# EAGLE design p2-001 (EAGLE 9.6.2)
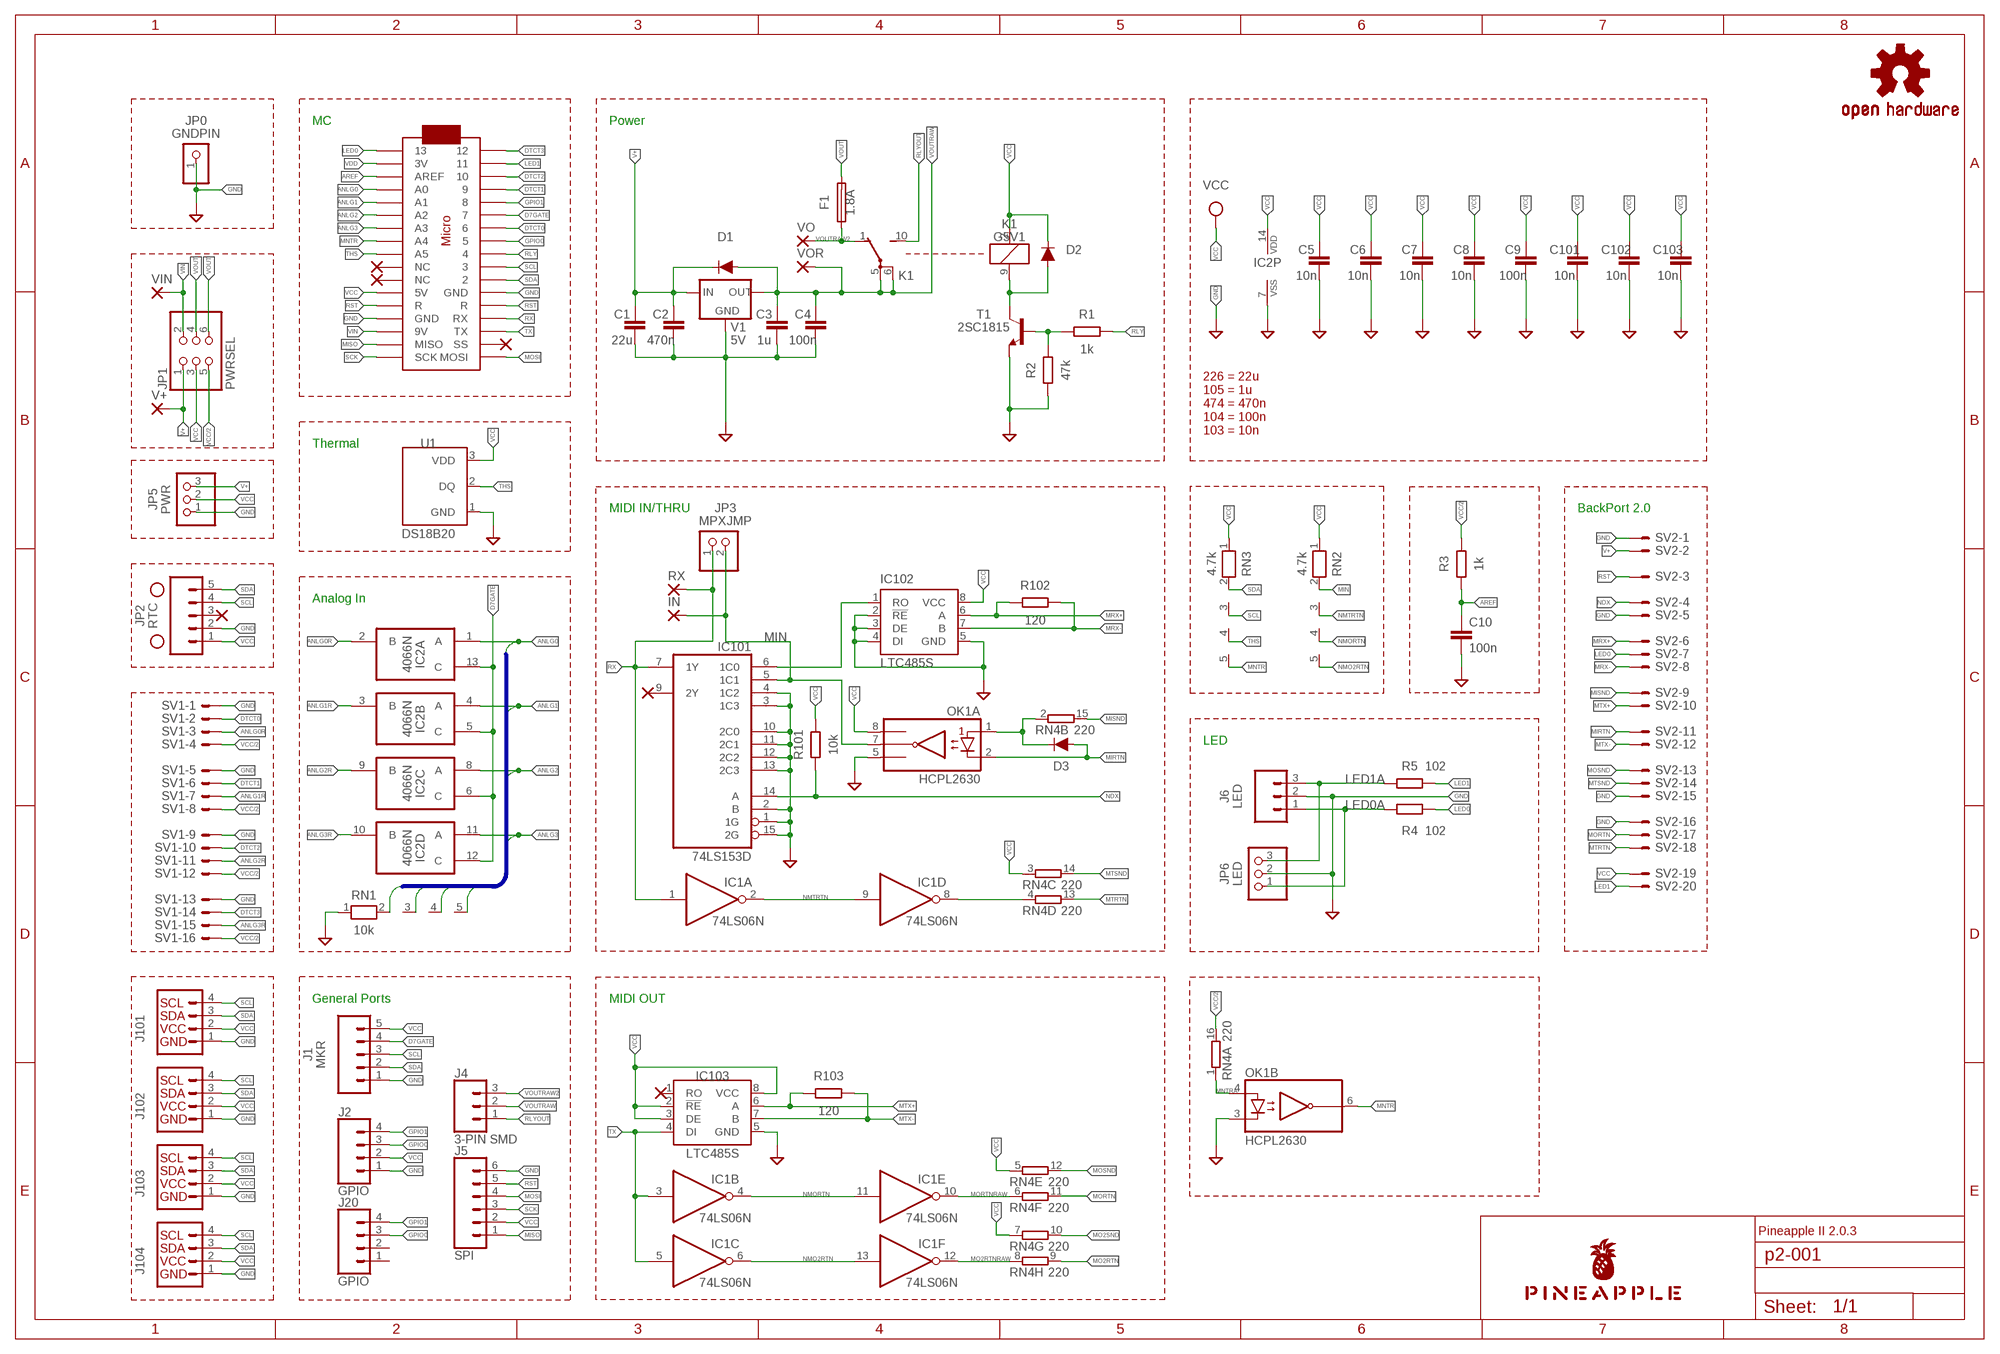
[diagram p0: schematic, sheet 1]

## Parts
C1  22u  C-EU025-050X050  [C025-050X050]
C2  470n  C-EU050-024X044  [C050-024X044]
C3  1u  C-EU050-024X044  [C050-024X044]
C4  100n  C-EU025-024X044  [C025-024X044]
C5  10n  C-EU025-024X044  [C025-024X044]
C6  10n  C-EU025-024X044  [C025-024X044]
C7  10n  C-EU025-024X044  [C025-024X044]
C8  10n  C-EU025-024X044  [C025-024X044]
C9  100n  C-EU025-024X044  [C025-024X044]
C10  100n  C-EU025-024X044  [C025-024X044]
C101  10n  C-EUC2012  [C2012]
C102  10n  C-EUC2012  [C2012]
C103  10n  C-EUC2012  [C2012]
D1  DIODE-1N4148  [DIODE-1N4148]
D2  DIODE-1N4148  [DIODE-1N4148]
D3  DIODE-1N4148  [DIODE-1N4148]
F1  1.8A  TE5  [TE5]
H1  STAND-OFF  [STAND-OFF]
H2  STAND-OFF  [STAND-OFF]
IC1  74LS06N  [DIL14]
IC2  4066N  [DIL14]
IC101  74LS153D  [SO16]
IC102  LTC485S  [SOIC8]
IC103  LTC485S  [SOIC8]
IN  SMD2  [SMD1,27-2,54]
J1  MKR  CONN_05JST  [JST-5-PTH]
J2  GPIO  CONN_04JST-PTH  [JST-4-PTH]
J4  3-PIN SMD  CONN_03JST-SMD  [JST-3-SMD]
J5  SPI  CONN_061.27MM  [1X06_1.27MM]
J6  LED  CONN_03JST-PTH  [JST-3-PTH]
J20  GPIO  CONN_041.27MM  [1X04_1.27MM]
J101  Qwiic  QWIIC_CONNECTORJS-1MM  [1X04_1MM_RA]
J102  Qwiic  QWIIC_CONNECTORJS-1MM  [1X04_1MM_RA]
J103  Qwiic  QWIIC_CONNECTORJS-1MM  [1X04_1MM_RA]
J104  Qwiic  QWIIC_CONNECTORJS-1MM  [1X04_1MM_RA]
JP0  GNDPIN  PINHD-1X1  [1X01]
JP1  PWRSEL  PINHD-2X3  [2X03]
JP2  RTC  CONN_05  [1X05]
JP3  MPXJMP  PINHD-1X2  [1X02]
JP5  PWR  PINHD-1X3  [1X03]
JP6  LED  PINHD-1X3  [1X03]
K1  G5V1  [G5V1]
LOGO1  OSHW-LOGOS-COPPER  [OSHW-LOGO-S_COPPER]
MC1  ARDUINOMICRO  [ARDUINOMICRO]
OK1  HCPL2630  [DIL08]
R1  1k  R-EU_0204/5  [0204/5]
R2  47k  R-EU_0204/5  [0204/5]
R3  1k  R-EU_0204/5  [0204/5]
R4  102  R-EU_0204/5  [0204/5]
R5  102  R-EU_0204/5  [0204/5]
R101  10k  R-EU_M2012  [M2012]
R102  120  R-EU_M2012  [M2012]
R103  120  R-EU_M2012  [M2012]
RN1  10k  RN04  [RN-5]
RN2  4.7k  RN04  [RN-5]
RN3  4.7k  RN04  [RN-5]
RN4  220  8R-N  [DIL16]
RX  SMD2  [SMD1,27-2,54]
SV1  ML16LE  [ML16L]
SV2  ML20LE  [ML20L]
T1  2SC1815  [TO92-ECB]
U1  DS18B20  [TO-92-AMMO]
U$1  PINEAPPLE450_SILK  [PINEAPPLE450_SILK]
V1  5V  78XXL  [78XXL]
V+  SMD2  [SMD1,27-2,54]
VIN  SMD2  [SMD1,27-2,54]
VO  SMD2  [SMD1,27-2,54]
VOR  SMD2  [SMD1,27-2,54]

## Nets
ANLG0 [analog]: IC2.1(A:A) MC1.P$31(A0) RN1.2
ANLG0R [analog]: IC2.2(A:B) SV1.3
ANLG1 [analog]: IC2.4(B:A) MC1.P$30(A1) RN1.3
ANLG1R [analog]: IC2.3(B:B) SV1.7
ANLG2 [analog]: IC2.8(C:A) MC1.P$29(A2) RN1.4
ANLG2R [analog]: IC2.9(C:B) SV1.11
ANLG3 [analog]: IC2.11(D:A) MC1.P$28(A3) RN1.5
ANLG3R [analog]: IC2.10(D:B) SV1.15
AREF: C10.1 MC1.P$32(AREF) R3.1
D7GATE: IC2.5(B:C) IC2.6(C:C) IC2.12(D:C) IC2.13(A:C) J1.4 MC1.P$6
DTCT0: MC1.P$7 SV1.2
DTCT1: MC1.P$4 SV1.6
DTCT2: MC1.P$3 SV1.10
DTCT3: MC1.P$1 SV1.14
GND [gnd]: C1.2 C2.2 C3.2 C4.2 C5.2 C6.2 C7.2 C8.2 C9.2 C10.2 C101.2 C102.2 C103.2 IC2.7(P:VSS) IC101.1(1G) IC101.2(B) IC101.3(1C3) IC101.4(1C2) IC101.10(2C0) IC101.11(2C1) IC101.12(2C2) IC101.13(2C3) IC101.15(2G) IC102.2(!RE) IC102.3(DE) IC102.4(DI) IC102.5(GND) IC103.5(GND) J1.1 J2.1 J5.6 J6.2 J101.1(GND) J102.1(GND) J103.1(GND) J104.1(GND) JP0.1 JP2.2 JP5.1 JP6.2 MC1.P$12(GND) MC1.P$21(GND) OK1.3(B:C2) OK1.5(A:GND) R2.1 RN1.1 SV1.1 SV1.5 SV1.9 SV1.13 SV2.1 SV2.5 SV2.15 SV2.16 T1.E U1.1(GND) V1.GND
GPIO0: J2.3 J20.3 MC1.P$8
GPIO1: J2.4 J20.4 MC1.P$5
LED0: MC1.P$34 R4.2 SV2.7
LED0A: J6.1 JP6.1 R4.1
LED1: MC1.P$2 R5.2 SV2.20
LED1A: J6.3 JP6.3 R5.1
MIDIINSND: D3.C OK1.1(A:A1) RN4.2
MIN: IC101.5(1C1) IN.1(P) JP3.2 OK1.7(A:VO1) RN2.2
MIRTN [external]: D3.A OK1.2(A:C1) SV2.11
MISND [external]: RN4.15 SV2.9
MISO: J5.1 MC1.P$19(MISO)
MNTR: MC1.P$27(A4) OK1.6(B:VO2) RN3.5
MNTRA: OK1.4(B:A2) RN4.1
MO2RTN: RN4.9
MO2RTNRAW: IC1.12(F:O) RN4.8
MO2SND: RN4.10
MORTN: RN4.11 SV2.17
MORTNRAW: IC1.10(E:O) RN4.6
MOSI: J5.4 MC1.P$17(MOSI)
MOSND: RN4.12 SV2.13
MRX: IC101.6(1C0) IC102.1(RO)
MRX+: IC102.6(A) R102.1 SV2.6
MRX-: IC102.7(B) R102.2 SV2.8
MTRTN: RN4.13 SV2.18
MTRTNRAW: IC1.8(D:O) RN4.4
MTSND: RN4.14 SV2.14
MTX+: IC103.6(A) R103.1 SV2.10
MTX-: IC103.7(B) R103.2 SV2.12
NDX: IC101.14(A) R101.1 SV2.4
NMO2RTN: IC1.6(C:O) IC1.13(F:I) RN2.5
NMORTN: IC1.4(B:O) IC1.11(E:I) RN2.4
NMTRTN: IC1.2(A:O) IC1.9(D:I) RN2.3
RLY: MC1.P$9 R1.2
RLYDRV: R1.1 R2.2 T1.B
RLYOUT: J4.1 K1.10(2:S)
RLYSNK: D2.A K1.9 T1.C
RST: J5.5 MC1.P$13(R) MC1.P$22(R) SV2.3
RX: IC1.1(A:I) IC101.7(1Y) JP3.1 MC1.P$14(RX) RX.1(P)
SCK: J5.3 MC1.P$18(SCK)
SCL: J1.3 J101.4(SCL) J102.4(SCL) J103.4(SCL) J104.4(SCL) JP2.4 MC1.P$10 RN3.3
SDA: J1.2 J101.3(SDA) J102.3(SDA) J103.3(SDA) J104.3(SDA) JP2.5 MC1.P$11 RN3.2
THS: MC1.P$26(A5) RN3.4 U1.2(DQ)
TX: IC1.3(B:I) IC1.5(C:I) IC103.4(DI) MC1.P$15(TX)
V+ [superpower]: C1.1 C2.1 D1.C JP1.1 JP5.3 SV2.2 V1.IN V+.1(P)
VCC [power]: C5.1 C6.1 C7.1 C8.1 C9.1 C101.1 C102.1 C103.1 D2.C IC2.14(P:VDD) IC102.8(VCC) IC103.2(!RE) IC103.3(DE) IC103.8(VCC) J1.5 J2.2 J5.2 J101.2(VCC) J102.2(VCC) J103.2(VCC) J104.2(VCC) JP1.3 JP2.1 JP5.2 K1.2 MC1.P$23(5V) OK1.8(A:VCC) R101.2 RN2.1 RN3.1 RN4.3 RN4.5 RN4.7 SV2.19 U1.3(VDD)
VCC/2 [superpower]: JP1.5 R3.2 RN4.16 SV1.4 SV1.8 SV1.12 SV1.16
VDD [power]: MC1.P$33(3V)
VIN [superpower]: JP1.2 MC1.P$20(9V) VIN.1(P)
VOUT [superpower]: F1.2 JP1.4 JP1.6
VOUTRAW [superpower]: C3.1 C4.1 D1.A J4.2 K1.5(2:P) K1.6(2:P) V1.OUT VOR.1(P)
VOUTRAW2 [superpower]: F1.1 J4.3 K1.1(2:O) VO.1(P)
Unconnected: IC101.9(2Y) IC103.1(RO) J20.1 J20.2 JP2.3 MC1.P$16(SS) MC1.P$24(NC) MC1.P$25(NC)

## Buses
ANLG[0..3]

## Notes on the sheet
- MC | Power
- 226 = 22u
  105 = 1u
  474 = 470n
  104 = 100n
  103 = 10n
- Thermal
- MIDI IN/THRU | BackPort 2.0
- Analog In
- LED
- General Ports | MIDI OUT
- Pineapple II 2.0.3

## Power pins joined to a net without a drawn wire
GND: IC1.7(P:GND) IC101.8(GND)
VCC: IC1.14(P:VCC) IC101.16(VCC)

## Library data of the parts
C1-C4 C9 C10 C101-C103 = rcl:C-EU: CAPACITOR, European symbol; SPICEPREFIX: C
C5-C8 = resistor:C-EU: CAPACITOR, European symbol
D1-D3 = SparkFun-DiscreteSemi:DIODE: Diode These are standard reverse protection diodes and small signal diodes. SparkFun Products: SparkFun SparkPunk Sound Kit <https://www.sparkfun.com/products/11177> SparkFun ESP8266 Thing <https://www.sparkfun.com/products/13231>; PROD_ID: DIO-08378; VALUE: 200mA/100V/1V
F1 = fuse:TE5: FUSE Wickmann; OC_FARNELL: unknown; OC_NEWARK: unknown
H1 H2 = SparkFun-Hardware:STAND-OFF: Stand Off Drill holes for mechanically mounting via screws, standoffs, etc. Note: Use the keepout ring to avoid running the screw head into surrounding components. Variant Overviews STAND-OFF - Mechanical footprint for a #4 phillips button head screw. STAND-OFF-TIGHT - Mechanical footprint for a #4 phillips button head screw, Example SparkFun Products Screw - Phillips Head (1/4", 4-40, 10 pack) <https://www.sparkfun.com/products/10453> (PRT-10453) Screw - Phillips Head (1/2", 4-40, 10 pack) <https://www.sparkfun.com/products/10452> (PRT-10452) Screw - Phillips Head (3/4", 4-40, 10 pack) <https://www.sparkfun.com/products/10451> (PRT-10451) Screw - Phillips Head (1", 4-40, 10 pack) <https://www.sparkfun.com/products/10450> (PRT-10450)
IC1 = 74xx-us:74*06: Hex INVERTER, open collector high-voltage output
IC2 = 40xx:4066: Quad bilateral ANALOG SWITCH
IC101 = 74xx-us:74*153: Dual 4-line to 1-line data SELECTOR/MULTIPLEXER
IC102 IC103 = linear-technology:LTC485: Low Power RS485 Interface Transceiver Source: http://www.linear.com/pc/downloadDocument.do?navId=H0,C1,C1007,C1017,P2064,D1718; OC_FARNELL: unknown; OC_NEWARK: unknown
IN RX V+ VIN VO VOR = wirepad:SMD2: SMD PAD
J1 = SparkFun-Connectors:CONN_05: Multi connection point. Often used as Generic Header-pin footprint for 0.1 inch spaced/style header connections On any of the 0.1 inch spaced packages, you can populate with these: Break Away Headers - Straight <https://www.sparkfun.com/products/116> (PRT-00116) Break Away Male Headers - Right Angle <https://www.sparkfun.com/products/553> (PRT-00553) Female Headers <https://www.sparkfun.com/products/115> (PRT-00115) Break Away Headers - Machine Pin <https://www.sparkfun.com/products/117> (PRT-00117) Break Away Female Headers - Swiss Machine Pin <https://www.sparkfun.com/products/743> (PRT-00743) For SCREWTERMINALS and SPRING TERMINALS visit here: Screw Terimnals on SparkFun.com <https://www.sparkfun.com/search/results?term=Screw+Terminals> (5mm/3.5mm/2.54mm spacing) This device is also useful as a general connection point to wire up your design to another part of your project. Our various solder wires solder well into these plated through hole pads. Hook-Up Wire - Assortment (Stranded, 22 AWG) <https://www.sparkfun.com/products/11375> (PRT-11375) Hook-Up Wire - Assortment (Solid Core, 22 AWG) <https://www.sparkfun.com/products/11367> (PRT-11367) View the entire wire category on our website here <https://www.sparkfun.com/categories/141> Special notes: Molex polarized connector foot print use with SKU : PRT-08231 with associated crimp pins and housings. 1MM SMD Version SKU: PRT-10208; SF_ID: PRT-09917
J2 = SparkFun-Connectors:CONN_04: Multi connection point. Often used as Generic Header-pin footprint for 0.1 inch spaced/style header connections On any of the 0.1 inch spaced packages, you can populate with these: Break Away Headers - Straight <https://www.sparkfun.com/products/116> (PRT-00116) Break Away Male Headers - Right Angle <https://www.sparkfun.com/products/553> (PRT-00553) Female Headers <https://www.sparkfun.com/products/115> (PRT-00115) Break Away Headers - Machine Pin <https://www.sparkfun.com/products/117> (PRT-00117) Break Away Female Headers - Swiss Machine Pin <https://www.sparkfun.com/products/743> (PRT-00743) For SCREWTERMINALS and SPRING TERMINALS visit here: Screw Terimnals on SparkFun.com <https://www.sparkfun.com/search/results?term=Screw+Terminals> (5mm/3.5mm/2.54mm spacing) This device is also useful as a general connection point to wire up your design to another part of your project. Our various solder wires solder well into these plated through hole pads. Hook-Up Wire - Assortment (Stranded, 22 AWG) <https://www.sparkfun.com/products/11375> (PRT-11375) Hook-Up Wire - Assortment (Solid Core, 22 AWG) <https://www.sparkfun.com/products/11367> (PRT-11367) View the entire wire category on our website here <https://www.sparkfun.com/categories/141> Special notes: Molex polarized connector foot print use with SKU : PRT-08231 with associated crimp pins and housings. 1MM SMD Version SKU: PRT-10208; PROD_ID: WIRE-13531; SF_ID: PRT-09916
J4 = SparkFun-Connectors:CONN_03: Multi connection point. Often used as Generic Header-pin footprint for 0.1 inch spaced/style header connections On any of the 0.1 inch spaced packages, you can populate with these: Break Away Headers - Straight <https://www.sparkfun.com/products/116> (PRT-00116) Break Away Male Headers - Right Angle <https://www.sparkfun.com/products/553> (PRT-00553) Female Headers <https://www.sparkfun.com/products/115> (PRT-00115) Break Away Headers - Machine Pin <https://www.sparkfun.com/products/117> (PRT-00117) Break Away Female Headers - Swiss Machine Pin <https://www.sparkfun.com/products/743> (PRT-00743) Stackable Header - 3 Pin (Female, 0.1") <https://www.sparkfun.com/products/13875> (PRT-13875) For SCREWTERMINALS and SPRING TERMINALS visit here: Screw Terimnals on SparkFun.com <https://www.sparkfun.com/search/results?term=Screw+Terminals> (5mm/3.5mm/2.54mm spacing) This device is also useful as a general connection point to wire up your design to another part of your project. Our various solder wires solder well into these plated through hole pads. Hook-Up Wire - Assortment (Stranded, 22 AWG) <https://www.sparkfun.com/products/11375> (PRT-11375) Hook-Up Wire - Assortment (Solid Core, 22 AWG) <https://www.sparkfun.com/products/11367> (PRT-11367) View the entire wire category on our website here <https://www.sparkfun.com/categories/141> Special notes: Molex polarized connector foot print use with SKU : PRT-08232 with associated crimp pins and housings.; PROD_ID: CONN-12591
J5 = SparkFun-Connectors:CONN_06: Multi connection point. Often used as Generic Header-pin footprint for 0.1 inch spaced/style header connections On any of the 0.1 inch spaced packages, you can populate with these: Break Away Headers - Straight <https://www.sparkfun.com/products/116> (PRT-00116) Break Away Male Headers - Right Angle <https://www.sparkfun.com/products/553> (PRT-00553) Female Headers <https://www.sparkfun.com/products/115> (PRT-00115) Break Away Headers - Machine Pin <https://www.sparkfun.com/products/117> (PRT-00117) Break Away Female Headers - Swiss Machine Pin <https://www.sparkfun.com/products/743> (PRT-00743) Arduino Stackable Header - 6 Pin <https://www.sparkfun.com/products/9280> (PRT-09280) For SCREWTERMINALS and SPRING TERMINALS visit here: Screw Terimnals on SparkFun.com <https://www.sparkfun.com/search/results?term=Screw+Terminals> (5mm/3.5mm/2.54mm spacing) This device is also useful as a general connection point to wire up your design to another part of your project. Our various solder wires solder well into these plated through hole pads. Hook-Up Wire - Assortment (Stranded, 22 AWG) <https://www.sparkfun.com/products/11375> (PRT-11375) Hook-Up Wire - Assortment (Solid Core, 22 AWG) <https://www.sparkfun.com/products/11367> (PRT-11367) View the entire wire category on our website here <https://www.sparkfun.com/categories/141>
J6 = SparkFun-Connectors:CONN_03: Multi connection point. Often used as Generic Header-pin footprint for 0.1 inch spaced/style header connections On any of the 0.1 inch spaced packages, you can populate with these: Break Away Headers - Straight <https://www.sparkfun.com/products/116> (PRT-00116) Break Away Male Headers - Right Angle <https://www.sparkfun.com/products/553> (PRT-00553) Female Headers <https://www.sparkfun.com/products/115> (PRT-00115) Break Away Headers - Machine Pin <https://www.sparkfun.com/products/117> (PRT-00117) Break Away Female Headers - Swiss Machine Pin <https://www.sparkfun.com/products/743> (PRT-00743) Stackable Header - 3 Pin (Female, 0.1") <https://www.sparkfun.com/products/13875> (PRT-13875) For SCREWTERMINALS and SPRING TERMINALS visit here: Screw Terimnals on SparkFun.com <https://www.sparkfun.com/search/results?term=Screw+Terminals> (5mm/3.5mm/2.54mm spacing) This device is also useful as a general connection point to wire up your design to another part of your project. Our various solder wires solder well into these plated through hole pads. Hook-Up Wire - Assortment (Stranded, 22 AWG) <https://www.sparkfun.com/products/11375> (PRT-11375) Hook-Up Wire - Assortment (Solid Core, 22 AWG) <https://www.sparkfun.com/products/11367> (PRT-11367) View the entire wire category on our website here <https://www.sparkfun.com/categories/141> Special notes: Molex polarized connector foot print use with SKU : PRT-08232 with associated crimp pins and housings.; PROD_ID: WIRE-10037; SF_ID: PRT-09915
J20 = SparkFun-Connectors:CONN_04: Multi connection point. Often used as Generic Header-pin footprint for 0.1 inch spaced/style header connections On any of the 0.1 inch spaced packages, you can populate with these: Break Away Headers - Straight <https://www.sparkfun.com/products/116> (PRT-00116) Break Away Male Headers - Right Angle <https://www.sparkfun.com/products/553> (PRT-00553) Female Headers <https://www.sparkfun.com/products/115> (PRT-00115) Break Away Headers - Machine Pin <https://www.sparkfun.com/products/117> (PRT-00117) Break Away Female Headers - Swiss Machine Pin <https://www.sparkfun.com/products/743> (PRT-00743) For SCREWTERMINALS and SPRING TERMINALS visit here: Screw Terimnals on SparkFun.com <https://www.sparkfun.com/search/results?term=Screw+Terminals> (5mm/3.5mm/2.54mm spacing) This device is also useful as a general connection point to wire up your design to another part of your project. Our various solder wires solder well into these plated through hole pads. Hook-Up Wire - Assortment (Stranded, 22 AWG) <https://www.sparkfun.com/products/11375> (PRT-11375) Hook-Up Wire - Assortment (Solid Core, 22 AWG) <https://www.sparkfun.com/products/11367> (PRT-11367) View the entire wire category on our website here <https://www.sparkfun.com/categories/141> Special notes: Molex polarized connector foot print use with SKU : PRT-08231 with associated crimp pins and housings. 1MM SMD Version SKU: PRT-10208
J101-J104 = SparkFun-Connectors:QWIIC_CONNECTOR: SparkFun I2C Standard Qwiic Connector An SMD 1mm pitch JST connector makes it easy and quick (get it? Qwiic?) to connect I2C devices to each other. The Qwiic system <http://www.sparkfun.com/qwiic> enables fast and solderless connection between popular platforms and various sensors and actuators. We carry 200mm <https://www.sparkfun.com/products/14204>, 100mm <https://www.sparkfun.com/products/14205>, 50mm <https://www.sparkfun.com/products/14206>, and breadboard friendly <https://www.sparkfun.com/products/14207> Qwiic cables. We also offer 10 pcs strips <https://www.sparkfun.com/products/14323> the SMD connectors.
JP0 = pinhead:PINHD-1X1: PIN HEADER
JP1 = pinhead:PINHD-2X3: PIN HEADER
JP2 = SparkFun-Connectors:CONN_05: Multi connection point. Often used as Generic Header-pin footprint for 0.1 inch spaced/style header connections On any of the 0.1 inch spaced packages, you can populate with these: Break Away Headers - Straight <https://www.sparkfun.com/products/116> (PRT-00116) Break Away Male Headers - Right Angle <https://www.sparkfun.com/products/553> (PRT-00553) Female Headers <https://www.sparkfun.com/products/115> (PRT-00115) Break Away Headers - Machine Pin <https://www.sparkfun.com/products/117> (PRT-00117) Break Away Female Headers - Swiss Machine Pin <https://www.sparkfun.com/products/743> (PRT-00743) For SCREWTERMINALS and SPRING TERMINALS visit here: Screw Terimnals on SparkFun.com <https://www.sparkfun.com/search/results?term=Screw+Terminals> (5mm/3.5mm/2.54mm spacing) This device is also useful as a general connection point to wire up your design to another part of your project. Our various solder wires solder well into these plated through hole pads. Hook-Up Wire - Assortment (Stranded, 22 AWG) <https://www.sparkfun.com/products/11375> (PRT-11375) Hook-Up Wire - Assortment (Solid Core, 22 AWG) <https://www.sparkfun.com/products/11367> (PRT-11367) View the entire wire category on our website here <https://www.sparkfun.com/categories/141> Special notes: Molex polarized connector foot print use with SKU : PRT-08231 with associated crimp pins and housings. 1MM SMD Version SKU: PRT-10208
JP3 = pinhead:PINHD-1X2: PIN HEADER
JP5 JP6 = pinhead:PINHD-1X3: PIN HEADER
K1 = relay:G5V1: RELAY 1 x switch, 0.5 A/125 V AC, 1 A/24 V DC , Omron; MPN: G5V-1-DC24; OC_FARNELL: 9949593; OC_NEWARK: 36M6377
LOGO1 = SparkFun-Aesthetics:OSHW-LOGO: Open-Source Hardware (OSHW) Logo This logo indicates the piece of hardware it is found on incorporates a OSHW license and/or adheres to the definition of open source hardware found here: http://freedomdefined.org/OSHW
MC1 = adafruit:ARDUINOMICRO
OK1 = optocoupler:HCPL2630: HEWLETT PACKARD OPTO COUPLER; MF: AGILENT TECHNOLOGIES; MPN: HCPL-2630-000E; OC_FARNELL: 9994904; OC_NEWARK: 88H7813
R1-R5 = resistor:R-EU_: RESISTOR, European symbol
R101-R103 = rcl:R-EU_: RESISTOR, European symbol; SPICEPREFIX: R
RN1-RN3 = resistor-net:RN04: RESISTOR NETWORK; OC_FARNELL: unknown; OC_NEWARK: unknown
RN4 = resistor-dil:8R-N: DIL RESISTOR; OC_FARNELL: unknown; OC_NEWARK: unknown
SV1 = con-ml:ML16LE: HARTING; OC_FARNELL: unknown; OC_NEWARK: unknown
SV2 = con-ml:ML20LE: HARTING; OC_FARNELL: unknown; OC_NEWARK: unknown
T1 = transistor:2SC1815: NPN EPITAXIAL TRANSISTOR Source: TOSHIBA .. 2SC1815 1.pdf
U1 = SparkFun-Sensors:DS18B20: Dallas/Maxim DS18B20 1-Wire Temperature Sensor The DS18B20 reports degrees C with 9 to 12-bit precision, -55C to 125C (+/-0.5C). Each sensor has a unique 64-Bit Serial number etched into it - allows for a huge number of sensors to be used on one data bus. Datasheet <http://datasheets.maximintegrated.com/en/ds/DS18B20.pdf> SparkFun Products One Wire Digital Temperature Sensor - DS18B20 <https://www.sparkfun.com/products/245> (SEN-00245); STORE_ID: SEN-00245
U$1 = pineapple:PINEAPPLE450_SILK
V1 = v-reg:78XXL: VOLTAGE REGULATOR

## Net classes
0 default: width 0.152 mm, drill 0.152 mm, clearance 0.152 mm
1 gnd: width 0.305 mm, drill 0.152 mm, clearance 0.152 mm
2 power: width 0.508 mm, drill 0.152 mm, clearance 0.152 mm
3 analog: width 0.305 mm, drill 0.152 mm, clearance 0.152 mm
4 external: width 0.152 mm, drill 0.152 mm, clearance 0.152 mm
5 superpower: width 1.016 mm, drill 0.152 mm, clearance 0.152 mm

## Board
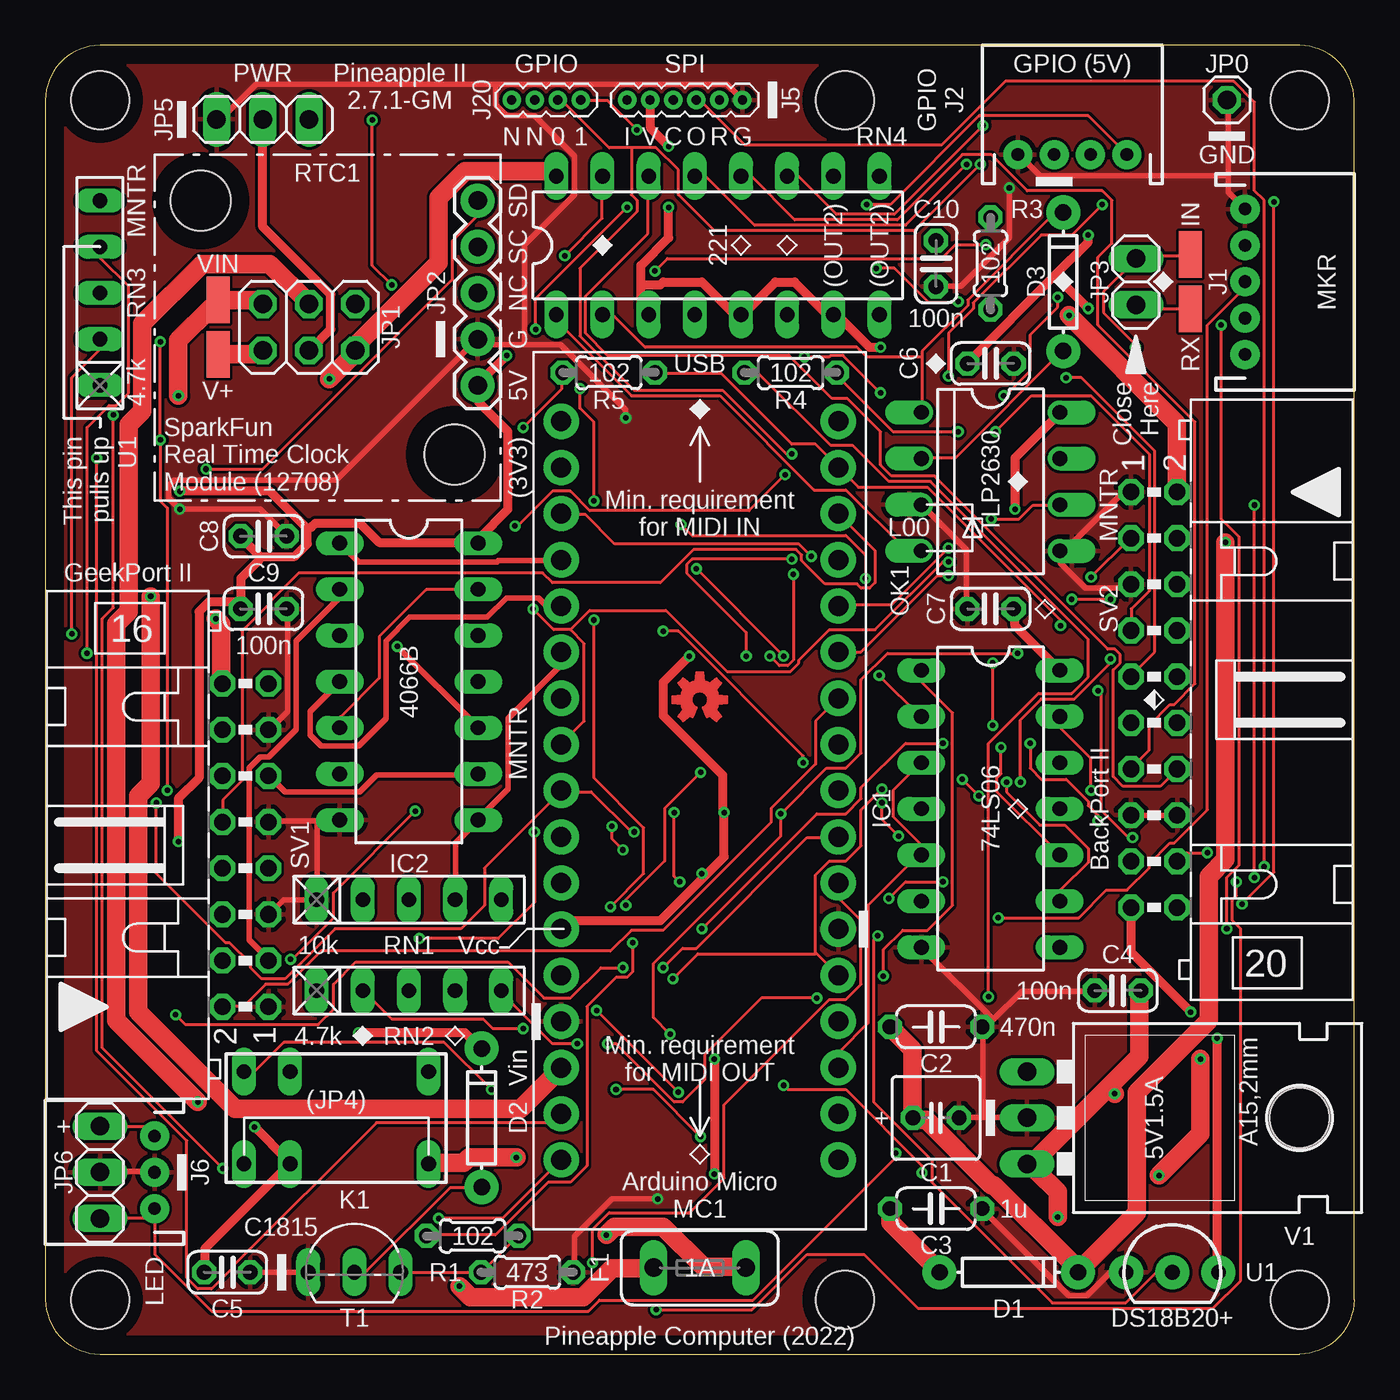
[diagram p1: board, top side]
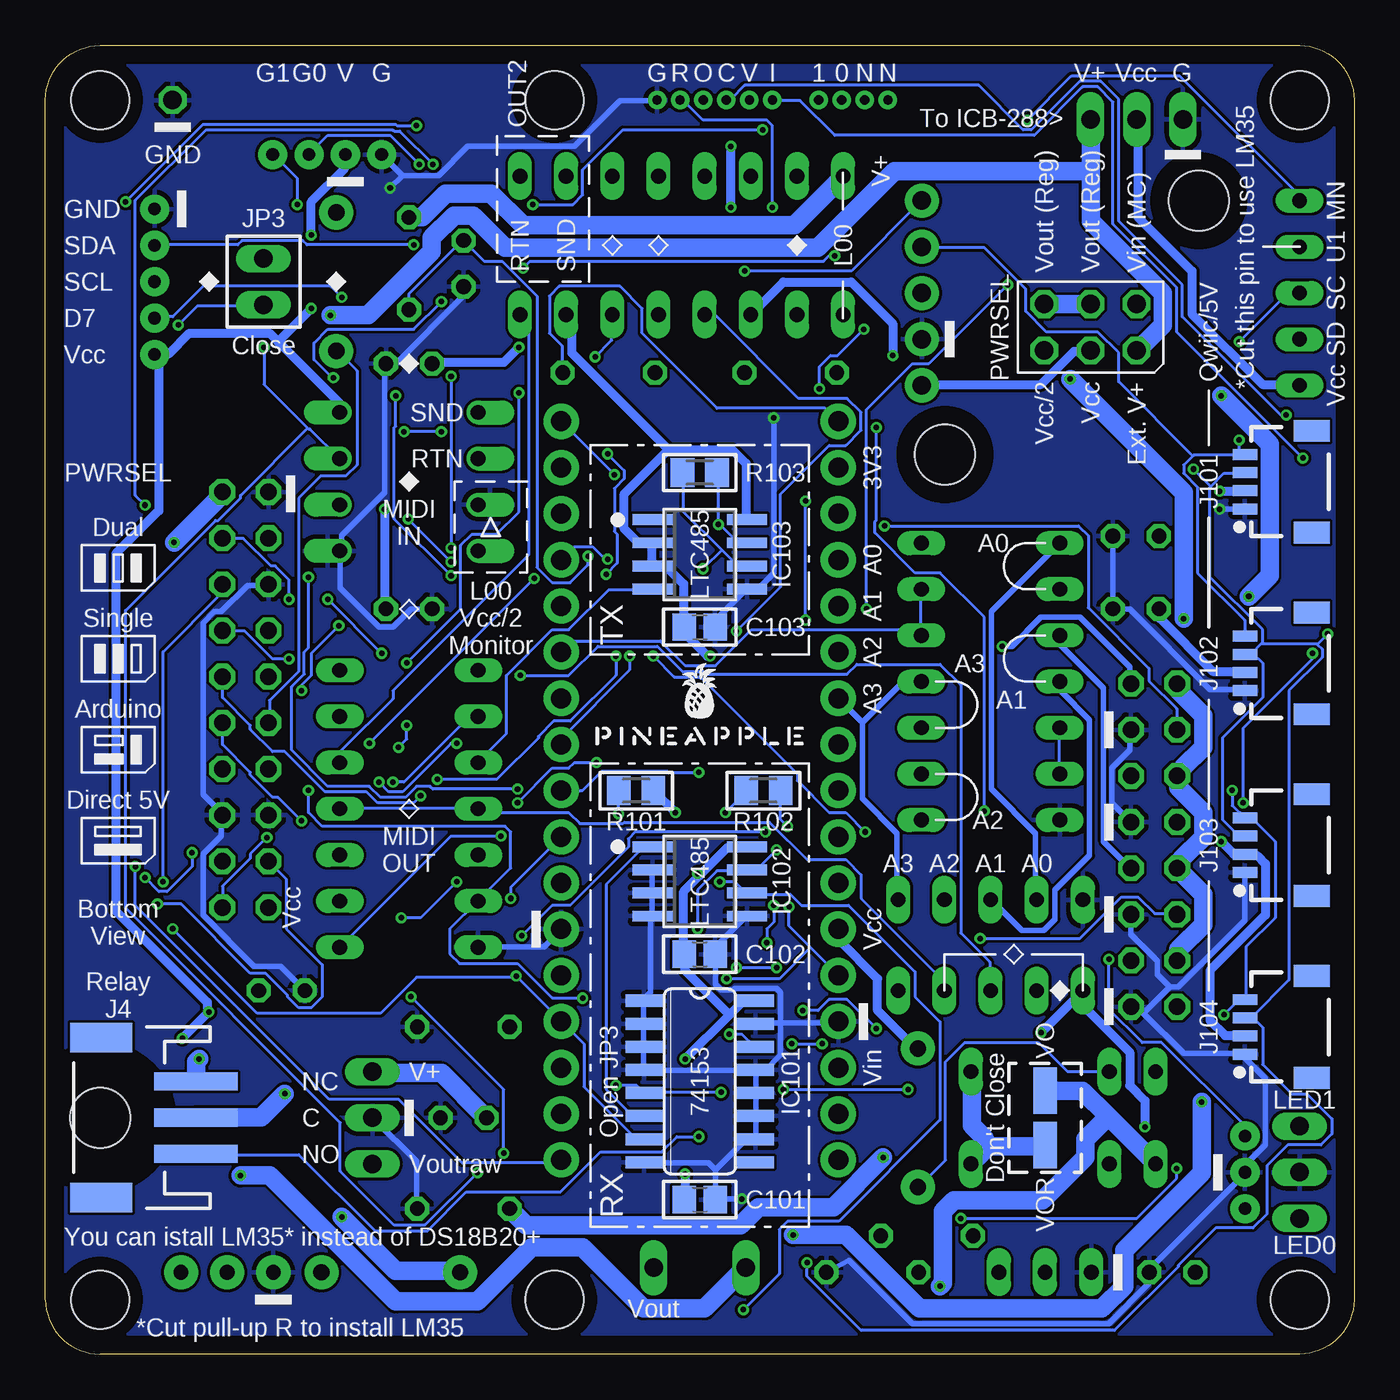
[diagram p2: board, bottom side, seen from below]

Size 72 x 72 mm. Coordinates in mm from the lower left corner, seen from the top.
Outline: 3,0 69,0 arc90 72,3 72,69 arc90 69,72 3,72 arc90 0,69 0,3 arc90 3,0
Copper layers (1*16): Top 0.035mm / dielectric 1.5mm / Bottom 0.035mm
Design rules "SeeedStudio_2layer_DRU_no_angle_20140221": minimum track width 6mil, minimum drill 12mil, track to track 6mil, track to pad 6mil, pad to pad 6mil, via to via 6mil, smd to smd 0mil, copper to edge 10mil, drill to drill 10mil, minimum pad ring 10mil, minimum via ring 6mil, stop-mask expansion 2mil, vias tented up to drill 100mil, thermal gap 10mil
Holes 3.2 mm at 3,3 69,3 69,69 3,69 44,69 44,3
tRestrict: area 0.8,66.8 to 5.2,71.2; area 66.8,66.8 to 71.2,71.2; area 0.8,0.8 to 5.2,5.2; area 66.8,0.8 to 71.2,5.2; area 41.8,66.8 to 46.2,71.2; area 41.8,0.8 to 46.2,5.2; area 0,71 to 72,72; area 0,0 to 72,1; area 0,0 to 1,72; area 71,0 to 72,72; area 5.9,60.9 to 11.1,66.1; area 19.9,46.9 to 25.1,52.1
bRestrict: area 0.8,0.8 to 5.2,5.2; area 66.8,0.8 to 71.2,5.2; area 66.8,66.8 to 71.2,71.2; area 0.8,66.8 to 5.2,71.2; area 41.8,66.8 to 46.2,71.2; area 41.8,0.8 to 46.2,5.2; area 0,71 to 72,72; area 0,0 to 72,1; area 0,0 to 1,72; area 71,0 to 72,72; area 5.9,60.9 to 11.1,66.1; area 19.9,46.9 to 25.1,52.1
vRestrict: area 30,33 to 42,38

### Footprints (pad centres in the part's own frame; a part is rotated, then mirrored left to right if it is on the bottom)
C025-050X050 = drill 0.813 octagon: 1 -1.27,0; 2 1.27,0
C050-024X044 = drill 0.813 octagon: 1 -2.54,0; 2 2.54,0
C025-024X044 = drill 0.813 octagon: 1 -1.27,0; 2 1.27,0
C2012 = smd 1.3 x 1.5: 1 -0.85,0; 2 0.85,0
DIODE-1N4148 = drill 0.9 pad 1.88: A -3.81,0; C 3.81,0
TE5 = drill 1.016 long: 1 -2.54,0; 2 2.54,0
STAND-OFF = hole 3.302: 0,0
DIL14 = drill 0.813 long: 1 -7.62,-3.81; 2 -5.08,-3.81; 3 -2.54,-3.81; 4 0,-3.81; 5 2.54,-3.81; 6 5.08,-3.81; 7 7.62,-3.81; 8 7.62,3.81; 9 5.08,3.81; 10 2.54,3.81; 11 0,3.81; 12 -2.54,3.81; 13 -5.08,3.81; 14 -7.62,3.81
SO16 = smd 0.66 x 2.032: 1 -4.445,-3.073; 2 -3.175,-3.073; 3 -1.905,-3.073; 4 -0.635,-3.073; 5 0.635,-3.073; 6 1.905,-3.073; 7 3.175,-3.073; 8 4.445,-3.073; 9 4.445,3.073; 10 3.175,3.073; 11 1.905,3.073; 12 0.635,3.073; 13 -0.635,3.073; 14 -1.905,3.073; 15 -3.175,3.073; 16 -4.445,3.073
SOIC8 = smd 0.6 x 2.2: 1 -1.905,-2.6; 2 -0.635,-2.6; 3 0.635,-2.6; 4 1.905,-2.6; 5 1.905,2.6; 6 0.635,2.6; 7 -0.635,2.6; 8 -1.905,2.6
SMD1,27-2,54 = smd 1.27 x 2.54: 1 0,0
JST-5-PTH = drill 0.7 pad 1.6: 1 -4,0; 2 -2,0; 3 0,0; 4 2,0; 5 4,0
JST-4-PTH = drill 0.7 pad 1.6: 1 -3,0; 2 -1,0; 3 1,0; 4 3,0
JST-3-SMD = smd 1 x 4.6: 1 -1.99,-4.77; 2 0.01,-4.77; 3 2.01,-4.77 | smd 1.6 x 3.4: NC1 -4.39,0.43; NC2 4.41,0.43
1X06_1.27MM = drill 0.508 pad 1: 1 0,0; 2 1.27,0; 3 2.54,0; 4 3.81,0; 5 5.08,0; 6 6.35,0
JST-3-PTH = drill 0.7 pad 1.6: 1 -2,0; 2 0,0; 3 2,0
1X04_1.27MM = drill 0.508 pad 1: 1 0,0; 2 1.27,0; 3 2.54,0; 4 3.81,0
1X04_1MM_RA = smd 0.6 x 1.35: 1 -1.5,0; 2 -0.5,0; 3 0.5,0; 4 1.5,0 | smd 1.2 x 2: NC1 2.8,-3.675; NC2 -2.8,-3.675
1X01 = drill 1.016 octagon: 1 0,0
2X03 = drill 1.016 octagon: 1 -2.54,-1.27; 2 -2.54,1.27; 3 0,-1.27; 4 0,1.27; 5 2.54,-1.27; 6 2.54,1.27
1X05 = drill 1.016 pad 1.88: 1 0,0; 2 2.54,0; 3 5.08,0; 4 7.62,0; 5 10.16,0
1X02 = drill 1.016 long: 1 -1.27,0; 2 1.27,0
1X03 = drill 1.016 long: 1 -2.54,0; 2 0,0; 3 2.54,0
G5V1 = drill 0.813 long: 1 -5.08,-2.54; 2 -2.54,-2.54; 5 5.08,-2.54; 6 5.08,2.54; 9 -2.54,2.54; 10 -5.08,2.54
ARDUINOMICRO = drill 1.1 pad 1.93: P$1 -20.32,7.62; P$2 -17.78,7.62; P$3 -15.24,7.62; P$4 -12.7,7.62; P$5 -10.16,7.62; P$6 -7.62,7.62; P$7 -5.08,7.62; P$8 -2.54,7.62; P$9 0,7.62; P$10 2.54,7.62; P$11 5.08,7.62; P$12 12.7,-7.62; P$13 10.16,-7.62; P$14 12.7,7.62; P$15 15.24,7.62; P$16 17.78,7.62; P$17 20.32,7.62; P$18 20.32,-7.62; P$19 17.78,-7.62; P$20 15.24,-7.62; P$21 7.62,7.62; P$22 10.16,7.62; P$23 7.62,-7.62; P$24 5.08,-7.62; P$25 2.54,-7.62; P$26 0,-7.62; P$27 -2.54,-7.62; P$28 -5.08,-7.62; P$29 -7.62,-7.62; P$30 -10.16,-7.62; P$31 -12.7,-7.62; P$32 -15.24,-7.62; P$33 -17.78,-7.62; P$34 -20.32,-7.62
DIL08 = drill 0.813 offset: 1 -3.81,-3.81; 2 -1.27,-3.81; 3 1.27,-3.81; 4 3.81,-3.81; 5 3.81,3.81; 6 1.27,3.81; 7 -1.27,3.81; 8 -3.81,3.81
0204/5 = drill 0.813 octagon: 1 -2.54,0; 2 2.54,0
M2012 = smd 1.3 x 1.6: 1 -0.95,0; 2 0.95,0
RN-5 = drill 0.813 long: 1 -5.08,0; 2 -2.54,0; 3 0,0; 4 2.54,0; 5 5.08,0
DIL16 = drill 0.813 long: 1 -8.89,-3.81; 2 -6.35,-3.81; 3 -3.81,-3.81; 4 -1.27,-3.81; 5 1.27,-3.81; 6 3.81,-3.81; 7 6.35,-3.81; 8 8.89,-3.81; 9 8.89,3.81; 10 6.35,3.81; 11 3.81,3.81; 12 1.27,3.81; 13 -1.27,3.81; 14 -3.81,3.81; 15 -6.35,3.81; 16 -8.89,3.81
ML16L = drill 0.914 octagon: 1 -8.89,-1.27; 2 -8.89,1.27; 3 -6.35,-1.27; 4 -6.35,1.27; 5 -3.81,-1.27; 6 -3.81,1.27; 7 -1.27,-1.27; 8 -1.27,1.27; 9 1.27,-1.27; 10 1.27,1.27; 11 3.81,-1.27; 12 3.81,1.27; 13 6.35,-1.27; 14 6.35,1.27; 15 8.89,-1.27; 16 8.89,1.27
ML20L = drill 0.914 octagon: 1 -11.43,-1.27; 2 -11.43,1.27; 3 -8.89,-1.27; 4 -8.89,1.27; 5 -6.35,-1.27; 6 -6.35,1.27; 7 -3.81,-1.27; 8 -3.81,1.27; 9 -1.27,-1.27; 10 -1.27,1.27; 11 1.27,-1.27; 12 1.27,1.27; 13 3.81,-1.27; 14 3.81,1.27; 15 6.35,-1.27; 16 6.35,1.27; 17 8.89,-1.27; 18 8.89,1.27; 19 11.43,-1.27; 20 11.43,1.27
TO92-ECB = drill 0.813 long: B 2.54,0; C 0,0; E -2.54,0
TO-92-AMMO = drill 0.813 pad 1.88: 1 -2.54,0; 2 0,0; 3 2.54,0
78XXL = drill 1.016 long: GND 0,-3.81; IN -2.54,-3.81; OUT 2.54,-3.81 | hole 3.302: 0,11.176

### Placement (x,y rotation side)
C1  49,13 0 top
C2  49,18 0 top
C3  49,8 0 top
C4  59,20 180 top
C5  10,4.5 0 top
C6  52,54.5 0 top
C7  52,41 180 top
C8  12,45 0 top
C9  12,41 0 top
C10  49,60 270 top
C101  36,8.5 0 bottom
C102  36,22 0 bottom
C103  36,40 0 bottom
D1  53,4.5 0 top
D2  24,13 90 top
D3  56,59 90 top
F1  36,4.75 0 top
H1  22.51,49.49 0 top
H2  8.54,63.46 0 top
IC1  52,30 270 top
IC2  20,37 270 top
IC101  36,15 270 bottom
IC102  36,26 270 bottom
IC103  36,44 270 bottom
IN  63,60.5 0 top
J1  66,59 270 top
J2  56.5,66 0 top
J4  68.5,13 90 bottom
J5  32,69 0 top
J6  6,10 90 top
J20  25.65,69 0 top
J101  6,48 90 bottom
J102  6,38 90 bottom
J103  6,28 90 bottom
J104  6,18 90 bottom
JP0  65,69 0 top
JP1  14.5,56.5 0 top
JP2  23.78,53.3 90 top
JP3  60,59 90 top
JP5  11.96,67.93 0 top
JP6  3,10 90 top
K1  16,13 0 top
LOGO1  36,36 0 top
MC1  36,31 270 top
OK1  52,48 270 top
R1  23.5,6.5 180 top
R2  26.5,4.5 180 top
R3  52,60 90 top
R4  41,54 0 top
R5  31,54 0 top
R101  39.5,31 0 bottom
R102  32.5,31 0 bottom
R103  36,48.5 0 bottom
RN1  20,25 0 top
RN2  20,20 0 top
RN3  3,58.38 90 top
RN4  37,61 0 top
RX  63,57.5 0 top
SV1  11,28 90 top
SV2  61,36 270 top
T1  17,4.5 0 top
U1  62,4.5 0 top
U$1  36,33.5 0 bottom
V1  57.82,13 270 top
V+  9.5,55 0 top
VIN  9.5,58 0 top
VO  17,14.5 0 bottom
VOR  17,11.5 0 bottom

### Tracks (layer width: path | path; a pad name or v marks a point on that pad's centre or on a via)
ANLG0
  Top 0.305: MC1.P$31 28.35,43.66 24.92,43.66 24.84,43.59 17.22,43.59 16.23,44.58 IC2.1
  Bottom 0.305: RN1.2 17.53,25.07 17.53,28.65 19.96,31.09 19.96,40.84 16.23,44.58 IC2.1
ANLG0R
  Top 0.305: IC2.2 16.15,42.06 16.15,41.6 13.79,39.24 13.79,34.37 12.27,32.84 11.81,32.84 11.2,32.23 11.2,22.78 12.27,21.72 SV1.3
ANLG1
  Top 0.305: MC1.P$30 28.35,41.22 27.51,41.22 27.13,41.6 25.38,41.6 24.31,40.54 20.04,40.54 18.75,39.24 18.75,34.98 17.22,33.45 15.16,33.45 14.55,34.06 14.55,35.36 16.15,36.96 IC2.4
  Bottom 0.305: IC2.4 16.15,36.96 16.15,36.5 14.55,34.9 14.55,27.43 16.46,25.53 16.46,23.93 17.07,23.32 18.29,23.32 19.96,24.99 RN1.3
ANLG1R
  Bottom 0.305: IC2.3 16.15,39.47 16.15,39.01 13.79,36.65 13.79,28.19 12.34,26.75 SV1.7
ANLG2
  Top 0.305: RN1.4 22.55,25.07 22.55,28.12 23.77,29.34 IC2.8 23.85,29.49 25.45,31.09 25.45,34.98 28.35,37.87 28.35,38.56 MC1.P$29
ANLG2R
  Top 0.305: IC2.9 23.77,31.85 18.21,31.85 17.3,30.94 13.18,30.94 12.34,31.77 SV1.11
ANLG3
  Bottom 0.305: 27.05,34.75 27.05,30.56 25.15,28.65 25.15,25.07 RN1.5 | 27.05,34.75 28.35,36.04 MC1.P$28 | 27.05,34.75 24.84,36.96 23.85,36.96 IC2.11
ANLG3R  (via drill 0.3)
  Top 0.305: v19.36,38.94 23.77,34.52 IC2.10
  Bottom 0.305: v19.36,38.94 18.82,38.94 17.22,40.54 15.09,40.54 12.34,37.8 12.34,36.96 SV1.15
AREF  (via drill 0.3)
  Top 0.152: v42.14,43.89 41.45,44.58 31.32,44.58 29.72,46.18 28.42,46.18 MC1.P$32
  Bottom 0.152: R3.1 52,58.34 49.07,61.27 C10.1 47.85,60.12 46.86,60.12 44.96,58.22 44.96,43.28 44.12,42.44 43.13,42.44 42.14,43.43 v42.14,43.89
D7GATE  (via drill 0.3)
  Top 0.152: IC2.5 16.23,34.52 16.23,35.05 18.36,37.19 18.36,39.47 20.95,42.06 23.77,42.06 IC2.13 | v55.7,58.14 55.7,57.61 54.18,56.08 54.18,54.1 52.81,52.73 v52.73,52.73 | v49.68,42.82 49.07,42.82 44.88,38.63 43.66,38.63 MC1.P$6
  Bottom 0.152: IC2.6 16.23,31.93 16.23,34.44 IC2.5 | 23.85,39.85 23.85,42.06 IC2.13 | 23.85,39.85 23.85,39.55 IC2.12 23.85,39.85 | v55.7,58.14 56.31,58.75 63.32,58.75 65,57.07 65.99,57.07 J1.4 | v52.73,52.73 52.73,51.05 52.81,50.98 52.81,45.95 v49.68,42.82 | 23.85,39.85 33.15,39.85 35.13,37.87 36.8,37.87 38.18,39.24 42.98,39.24 43.59,38.63 MC1.P$6
DTCT0
  Top 0.152: SV1.2 9.75,19.13 10.9,19.13 12.12,20.34 13.34,20.34 15.16,22.17 31.09,22.17 32.23,23.32 33.98,23.32 39.93,29.26 39.93,30.02 42.37,32.46 42.37,34.82 43.59,36.04 MC1.P$7
DTCT1  (via drill 0.3)
  Top 0.152: v20.57,22.86 24.92,22.86 26.9,24.84 v26.9,28.73 | v38.56,38.41 38.56,39.7 35.28,42.98 35.28,43.43 35.59,43.74 v41.07,43.74
  Bottom 0.152: v20.57,22.86 15.09,22.86 12.8,25.15 11.89,25.15 10.97,24.23 9.75,24.23 SV1.6 | v26.9,28.73 27.96,29.79 28.88,29.79 30.63,31.55 30.63,31.93 35.97,37.26 37.41,37.26 v38.56,38.41 | v41.07,43.74 41.22,43.74 41.91,44.42 42.9,44.42 43.59,43.74 MC1.P$4
DTCT2
  Top 0.152: SV1.10 9.75,29.34 9.75,30.48 10.82,31.55 10.82,39.78 12.34,41.3 12.34,41.38 13.95,42.98 27.36,42.98 27.89,42.44 33.83,42.44 35.66,44.27 41.3,44.27 41.6,43.97 41.6,43.66 42.9,42.37 44.65,42.37 44.88,42.14 45.34,42.14 45.64,42.44 45.64,44.2 43.66,46.18 MC1.P$3
DTCT3  (via drill 0.3)
  Top 0.152: v25.83,45.57 25.98,45.57 27.89,47.47 28.88,47.47 29.95,46.41 38.71,46.41 v40.69,48.39
  Bottom 0.152: v25.83,45.57 15.16,45.57 14.63,45.03 14.63,41.07 11.28,37.72 11.28,37.03 9.75,35.51 9.75,34.37 SV1.14 | v40.69,48.39 43.59,51.28 MC1.P$1
GND  (via drill 0.3)
  Top 0.305: C8.2 13.26,45.03 11.81,46.48 v7.39,46.48 6.78,47.09 6.78,47.78 7.09,48.08 16,48.08 23.7,55.78 JP2.2 23.85,55.78 24.08,55.55 26.36,55.55 | SV1.5 12.34,24.23 13.11,24.99 14.86,24.99 RN1.1 14.94,25.15 14.94,29.26 IC2.7 16.15,29.34 12.34,29.34 SV1.9 | C9.2 13.34,41 13.34,35.36 12.34,34.37 SV1.13 | C5.2 14.4,4.5 T1.E | JP6.2 3.05,10.06 5.94,10.06 J6.2 | v33.68,8.53 31.17,8.53 29.11,6.48 29.11,4.57 R2.1 | C7.2 50.67,41.07 50.67,44.27 48.23,46.71 OK1.3 | SV2.5 59.66,42.29 59.51,42.14 57.23,42.14 55.85,43.51 55.85,44.12 OK1.5 56.01,44.12 59.28,47.4 59.66,47.4 SV2.1 | SV2.15 62.26,29.64 SV2.16 | 51.59,13.03 53.95,13.03 V1.GND | 51.59,13.03 50.29,13.03 C1.2 | 51.59,13.03 51.59,17.98 C2.2 51.74,17.98 52.16,18.4 | 52.16,18.4 53.72,19.96 57.68,19.96 C4.2 | U1.1 59.44,4.5 58.6,4.5 57.3,3.2 56.31,3.2 51.59,7.92 C3.2 | 52.16,18.4 48.23,22.33 IC1.7 | v31.93,51.51 31.93,51.97 28.35,55.55 26.36,55.55 | 65.08,64.85 65.08,63.93 65.99,63.02 J1.1 | 65.08,64.85 65.08,68.96 JP0.1 | 24.77,69.88 37.49,69.88 38.33,69.04 J5.6 | 24.77,69.88 11.58,69.88 9.68,67.97 9.45,67.97 JP5.1 | 65.08,64.85 54.71,64.85 53.57,65.99 J2.1 | 26.36,55.55 26.36,61.04 29.11,63.78 29.11,65.91 26.9,68.12 25.38,68.12 24.77,68.73 24.77,69.88 | v53.03,64.16 53.03,61.42 50.37,58.75 49.07,58.75 C10.2
  Bottom 0.305: v7.39,46.48 6.02,46.48 J101.1 | J102.1 6.02,36.58 7.92,36.58 12.34,41 C9.2 13.26,41.15 13.26,44.96 C8.2 | SV1.13 12.34,34.29 12.34,33.22 13.34,32.23 13.34,30.33 12.34,29.34 SV1.9 | IC102.5 33.45,24.08 35.13,22.4 35.13,22.02 C102.2 35.13,21.87 35.13,20.34 34.82,20.04 34.14,20.04 34.06,20.12 31.77,20.12 31.55,19.89 31.55,18.21 | 31.55,18.21 28.5,18.21 28.42,18.29 MC1.P$12 | 31.55,18.21 32.92,18.21 IC101.15 | IC102.2 38.63,26.59 38.63,25.45 IC102.3 38.63,25.3 38.63,24.16 IC102.4 38.71,24 38.71,19.89 39.01,19.58 IC101.1 39.09,19.43 39.09,18.29 IC101.2 39.09,18.14 39.09,16.99 IC101.3 39.09,16.84 39.09,15.7 IC101.4 38.94,15.62 33.07,15.62 IC101.13 | 35.13,10.13 35.13,8.53 C101.2 34.98,8.53 v33.68,8.53 | 35.13,10.13 33.45,11.81 32.99,11.81 IC101.10 32.92,11.96 32.92,13.03 IC101.11 32.92,13.18 32.92,14.33 IC101.12 32.92,14.48 32.92,15.62 IC101.13 | 35.13,10.13 35.51,10.52 39.01,10.52 IC101.8 | 31.55,18.21 31.55,16.46 32.38,15.62 32.77,15.62 IC101.13 | R2.1 27.8,5.17 24.31,1.68 13.49,1.68 11.28,3.89 C5.2 11.28,4.65 6.02,9.91 J6.2 5.94,10.06 5.94,10.44 4.88,11.51 4.88,15.16 6.1,16.38 J104.1 6.02,16.54 9.37,16.54 11.58,18.75 | 11.58,18.75 11.89,19.05 12.27,19.05 SV1.1 | 10.13,20.19 9.68,20.19 6.02,23.85 6.02,26.44 J103.1 | 11.58,18.75 10.13,20.19 | 10.13,20.19 10.82,20.88 10.82,21.64 12.27,23.09 12.27,24.16 SV1.5 | C10.2 49.07,58.67 49.07,58.14 52.65,54.56 53.26,54.56 C6.2 53.34,54.41 53.34,47.4 55.7,45.03 55.7,44.27 OK1.5 55.78,44.12 55.78,42.14 53.65,40.01 52.88,40.01 51.89,41 50.75,41 C7.2 | IC1.7 48.16,22.4 44.58,22.4 43.66,23.32 MC1.P$21
  Bottom 0.305: C3.2 51.59,8 51.59,10.59 53.95,12.95 V1.GND | C4.2 57.76,20.04 59.05,21.34 60.5,21.34 63.32,24.16 63.32,27.51 62.33,28.5 62.33,29.64 SV2.16 62.33,29.79 63.32,30.79 63.32,40.23 62.71,40.84 62.33,40.84 60.88,42.29 59.74,42.29 SV2.5 | C103.2 35.13,40.01 35.13,40.39 33.45,42.06 IC103.5 33.3,42.22 32.69,42.22 31.93,42.98 v31.93,51.51 | 52.35,64.85 50.37,64.85 48.77,66.45 42.9,66.45 40.39,68.96 38.41,68.96 J5.6 | 52.35,64.85 J2.1 | 52.35,64.85 v53.03,64.16
  pour Top: -1,-1 73,-1 73,73 -1,73
  pour Bottom: -2,-2 74,-2 74,74 -2,74
GPIO0  (via drill 0.3)
  Top 0.152: 32.23,66.37 33.6,66.37 34.82,65.15 34.82,63.78 36.8,61.8 47.78,61.8 v51.44,65.46 | 32.23,66.37 31.01,66.37 28.42,68.96 28.19,68.96 J20.3 | v39.85,38.41 40.39,37.87 40.84,37.87 41.15,38.18 v41.15,42.9 | v41.07,49.53 40.77,49.53 37.26,53.03 32.38,53.03 29.41,56.01 29.41,59.74 32.54,62.87 32.54,63.48 32.23,63.78 32.23,66.37
  Bottom 0.152: v51.44,65.46 53.03,67.06 56.46,67.06 57.45,66.06 J2.3 | v39.85,38.41 39.85,37.64 43.59,33.91 43.59,33.6 MC1.P$8 | v41.15,42.9 40.54,43.51 40.54,45.11 40.69,45.26 40.69,47.62 40.16,48.16 40.16,48.62 v41.07,49.53
GPIO1  (via drill 0.3)
  Top 0.152: v32.54,67.36 30.94,68.96 29.49,68.96 J20.4 | v45.19,63.25 46.48,63.25 51.36,68.12 57.38,68.12 59.44,66.06 J2.4 | v49.68,44.35 46.56,41.22 43.66,41.22 MC1.P$5 | v49.68,53.8 49.68,56.16 51.05,57.53 51.05,57.84 54.79,61.57 56.46,61.57 v58.14,63.25
  Bottom 0.152: v32.54,67.36 40.23,67.36 42.44,65.15 42.44,63.78 42.98,63.25 v45.19,63.25 | v49.68,53.8 v49.68,44.35 | v58.14,63.25 58.14,64.69 59.44,65.99 J2.4
LED0  (via drill 0.3)
  Top 0.152: v52.27,50.75 54.25,52.73 57.53,52.73 60.73,49.53 60.73,41.99 59.74,41 59.74,39.85 SV2.7 | v50.22,50.75 46.63,50.75 43.59,53.8 43.59,53.95 R4.2
  Bottom 0.152: R4.2 43.59,54.03 43.59,55.47 44.27,56.16 44.27,58.22 43.74,58.75 40.39,58.75 39.17,57.53 39.17,56.16 35.05,52.05 29.11,52.05 28.42,51.36 MC1.P$34 | v50.22,50.75 v52.27,50.75
LED0A  (via drill 0.3)
  Top 0.152: v51.89,19.66 51.89,33.6 54.63,36.35 56.46,36.35 57.38,37.26 57.38,39.32 48.69,48.01 46.41,48.01 44.42,49.99 43.2,49.99 39.24,53.95 38.48,53.95 R4.1 | v46.79,11.05 46.79,10.82 38.94,2.97 30.48,2.97 29.87,2.36 9.14,2.36 6.02,5.49 6.02,7.47 | 6.02,7.47 6.02,7.92 J6.1 6.02,7.47 | 6.02,7.47 3.05,7.47 JP6.1
  Bottom 0.152: v51.89,19.66 46.79,14.55 v46.79,11.05
LED1  (via drill 0.3)
  Top 0.152: R5.2 33.6,53.95 37.19,53.95 41.07,50.06 42.37,50.06 43.59,48.84 MC1.P$2 43.66,48.77 44.73,47.7 48.54,47.7 55.85,40.39 v55.85,40.08 | v59.82,28.42 59.59,28.42 58.06,29.95 58.06,36.35 v57.91,36.5
  Bottom 0.152: v59.82,28.42 60.73,27.51 60.73,27.28 62.26,25.76 62.26,24.61 SV2.20 | v57.91,36.5 57.91,36.8 57.38,37.34 57.38,38.56 v55.85,40.08
LED1A  (via drill 0.3)
  Top 0.152: v26.29,50.98 28.42,53.11 28.42,53.95 R5.1 | v20.34,29.87 15.85,25.38 15.85,24 13.56,21.72 v13.49,21.72 | JP6.3 3.05,12.5 5.49,12.5 5.94,12.04 J6.3
  Bottom 0.152: v26.29,50.98 26.29,45.87 26.36,45.8 26.36,45.19 24.16,42.98 22.78,42.98 20.34,40.54 v20.34,29.87 | v13.49,21.72 13.49,18.97 11.66,17.14 10.59,17.14 6.02,12.57 6.02,12.04 J6.3
MIDIINSND
  Top 0.152: 48.23,54.86 48.23,55.17 50.75,57.68 50.75,57.99 55.55,62.79 55.93,62.79 D3.C | 48.23,54.86 48.23,51.82 OK1.1 | 48.23,54.86 45.19,54.86 44.65,55.4 32.99,55.4 31.24,57.15 30.71,57.15 RN4.2
MIN  (via drill 0.3)
  Top 0.152: IN.1 62.94,60.43 60.2,60.43 60.05,60.27 JP3.2 59.97,60.2 58.22,58.45 58.22,57.3 59.97,55.55 v59.97,55.4 | v30.33,18.9 v34.82,14.4 | v26.29,17.91 24.61,17.91 24.08,18.44 19.05,18.44 17.53,19.96 RN2.2 | v48.23,9.98 48.23,10.36 44.04,14.55 40.84,14.55 v40.62,14.78
  Bottom 0.152: 57.57,50.94 59.97,53.34 v59.97,55.4 | 57.57,50.94 57.53,50.9 57.45,50.9 55.85,49.3 OK1.7 | v34.82,14.4 39.01,14.4 IC101.5 39.09,14.4 39.47,14.78 v40.62,14.78 | v30.33,18.9 29.49,18.9 28.88,19.51 27.89,19.51 v26.29,17.91 | 57.57,50.94 61.27,47.24 61.27,47.09 62.48,45.87 62.64,45.87 67.59,40.92 67.59,24.54 55.78,12.72 55.78,10.06 52.81,7.09 51.13,7.09 v48.23,9.98
MIRTN
  Top 0.152: OK1.2 48.23,49.3 50.06,49.3 55.93,55.17 D3.A
  Bottom 0.152: SV2.11 59.66,34.75 59.66,35.97 58.06,37.57 58.06,47.09 56.84,48.31 55.47,48.31 54.86,48.92 54.86,54.1 55.93,55.17 D3.A
MISND  (via drill 0.3)
  Top 0.152: v28.57,60.43 30.63,62.48 30.63,64.77 RN4.15 | v45.72,59.74 46.71,59.74 48.62,57.84 50.14,57.84 v50.22,57.91 | v56.16,53.72 57,53.72 61.04,49.68 61.04,38.63 59.74,37.34 SV2.9
  Bottom 0.152: v28.57,60.43 28.88,60.43 29.18,60.12 45.34,60.12 v45.72,59.74 | v50.22,57.91 51.74,56.39 56.46,56.39 57.23,55.63 57.23,54.71 56.24,53.72 v56.16,53.72
MISO  (via drill 0.3)
  Top 0.152: v2.82,49.3 2.82,16.69 7.77,11.73 7.77,4.19 8.38,3.58 9.14,3.58 10.36,4.8 10.36,4.88 18.21,12.72 27.89,12.72 28.35,13.18 MC1.P$19
  Bottom 0.152: v2.82,49.3 9.75,56.24 9.75,58.67 13.26,62.18 13.26,68.89 14.1,69.72 14.94,69.72 17.6,67.06 28.57,67.06 30.48,68.96 31.93,68.96 J5.1
MNTR  (via drill 0.3)
  Top 0.152: v17.98,67.89 17.98,59.89 v19.05,58.83 | v26.82,41 27.96,39.85 28.88,39.85 | 28.88,39.85 29.64,39.09 29.64,34.82 28.42,33.6 MC1.P$27 | v52.05,45.95 53.57,45.95 54.33,46.71 55.78,46.71 OK1.6 | v49.68,43.59 49.38,43.59 45.64,39.85 43.13,39.85 41.45,38.18 41.45,38.02 41,37.57 37.49,37.57 34.14,40.92 29.95,40.92 28.88,39.85
  Bottom 0.152: v17.98,67.89 15.54,70.33 9.6,70.33 3.05,63.78 3.05,63.48 RN3.5 | v19.05,58.83 23.39,54.48 24.31,54.48 26.82,51.97 v26.82,41 | v49.68,43.59 v52.05,45.95
MNTRA
  Top 0.152: OK1.4 48.16,44.2 47.4,44.2 44.04,47.55 42.29,47.55 37.11,52.73 32.23,52.73 28.12,56.84 28.12,57.15 RN4.1
MO2RTNRAW
  Bottom 0.152: IC1.12 55.78,32.61 55.78,33.15 52.88,36.04 52.88,36.5 45.41,43.97 45.41,56.69 45.87,57.15 RN4.8
MORTN  (via drill 0.3)
  Top 0.152: v51.59,67.59 46.71,62.71 43.51,62.71 41.45,64.77 40.84,64.77 RN4.11 | v67.59,63.4 67.59,26.52 v65.84,24.77
  Bottom 0.152: v51.59,67.59 52.65,67.59 52.73,67.67 63.32,67.67 v67.59,63.4 | v65.84,24.77 64.54,24.77 60.73,20.95 59.89,20.95 58.67,19.74 58.67,19.66 58.06,19.05 57.38,19.05 56.77,19.66 56.77,21.41 58.75,23.39 58.75,26.14 59.66,27.05 SV2.17
MORTNRAW  (via drill 0.3)
  Top 0.152: v41.76,54.86 43.13,54.86 43.2,54.94 43.89,54.94 v45.95,52.88 | v52.12,34.59 v52.12,38.02 | v52.58,33.38 52.58,31.93 52.35,31.7 52.35,30.94 55.78,27.51 IC1.10
  Bottom 0.152: v41.76,54.86 40.84,55.78 40.84,57.15 RN4.6 | v45.95,52.88 45.95,46.33 47.17,45.11 48.54,45.11 49.15,44.5 49.15,41 v52.12,38.02 | v52.12,34.59 52.12,33.83 v52.58,33.38
MOSI  (via drill 0.3)
  Top 0.152: v67.06,26.82 67.06,63.48 66.52,64.01 66.52,68.89 65.38,70.03 52.81,70.03 49.3,66.52 38.48,66.52 36.04,68.96 35.81,68.96 J5.4
  Bottom 0.152: v67.06,26.82 67.06,24.69 56.39,14.02 52.58,14.02 49.07,10.52 43.81,10.52 43.66,10.67 MC1.P$17
MOSND
  Top 0.152: RN4.12 38.33,64.77 38.86,64.77 41.22,62.41 46.86,62.41 50.44,65.99 52.05,65.99 54.03,64.01 58.14,64.01 58.67,63.48 58.67,61.11 57.91,60.35 57.91,56.62 63.25,51.28 63.25,36.88 62.1,35.74 61.87,35.74 60.73,34.59 60.73,33.22 59.74,32.23 SV2.13
MRX
  Bottom 0.152: IC101.6 39.09,13.11 39.7,13.11 41.15,14.55 41.15,25.83 39.09,27.89 38.63,27.89 IC102.1
MRX+  (via drill 0.3)
  Top 0.152: v34.59,29.79 34.59,26.29 v34.9,25.98 | v65.53,25.98 65.53,25.22 65.3,24.99 65.3,23.85 65.76,23.39 65.76,4.04 64.24,2.52 48.01,2.52 45.03,5.49 41.91,5.49 38.86,2.44 v33.6,2.44
  Bottom 0.152: v34.59,29.79 33.45,30.94 R102.1 | v34.9,25.98 34.06,25.98 33.45,25.38 IC102.6 33.38,25.3 31.01,25.3 30.4,24.69 27.81,24.69 24.16,21.03 24.16,19.66 22.78,18.29 22.78,12.88 28.35,7.32 31.17,7.32 31.62,6.86 31.62,4.42 v33.6,2.44 | v65.53,25.98 65.53,38.63 62.33,41.83 62.33,42.29 SV2.6
MRX-  (via drill 0.3)
  Top 0.152: v31.17,29.03 31.17,28.35 v31.77,27.74 | v58.6,38.25 58.6,38.02 56.62,36.04 54.79,36.04 53.65,34.9 v53.65,31.47 | v49.38,33.6 47.32,33.6 44.88,31.17 44.88,30.56 44.04,29.72 42.44,29.72 v36.12,23.39
  Bottom 0.152: v31.17,29.03 31.55,29.41 31.55,30.94 R102.2 | v31.77,27.74 32.84,26.67 33.38,26.67 IC102.7 33.45,26.59 35.05,26.59 36.12,25.53 v36.12,23.39 | v58.6,38.25 59.51,38.25 61.04,39.78 62.26,39.78 SV2.8 | v53.65,31.47 53.11,30.94 52.35,30.94 49.68,33.6 v49.38,33.6
MTRTN  (via drill 0.3)
  Top 0.152: v50.67,65.46 47.32,62.1 39.01,62.1 36.35,64.77 35.74,64.77 RN4.13 | v66.52,26.21 v66.52,46.71 | v63.93,27.58 62.79,27.58 62.33,27.13 SV2.18
  Bottom 0.152: v50.67,65.46 52.5,67.28 52.81,67.28 52.88,67.36 63.17,67.36 67.06,63.48 67.06,47.24 v66.52,46.71 | v66.52,26.21 65.76,25.45 65.3,25.45 63.93,26.82 v63.93,27.58
MTRTNRAW  (via drill 0.3)
  Top 0.152: v33.98,39.78 34.82,39.78 41.68,32.92 v41.68,32.54 | v46.02,30.33 46.02,29.41 v46.94,28.5
  Bottom 0.152: v33.98,39.78 31.55,42.22 31.55,47.32 28.88,49.99 27.96,49.99 27.13,50.83 27.13,51.82 27.89,52.58 30.56,52.58 35.13,57.15 35.66,57.15 RN4.4 | v41.68,32.54 42.9,32.54 43.2,32.23 44.12,32.23 v46.02,30.33 | v46.94,28.5 49.68,28.5 55.78,22.4 IC1.8
MTSND
  Top 0.152: RN4.14 33.15,64.77 33.15,61.65 29.72,58.22 29.72,56.16 30.94,54.94 40.92,54.94 43.28,52.58 44.12,52.58 45.95,50.75 45.95,48.92 46.56,48.31 48.92,48.31 58.45,38.79 58.83,38.79 59.13,38.48 59.13,38.02 58.75,37.64 58.75,31.77 59.28,31.24 61.34,31.24 62.26,32.16 SV2.14
MTX+  (via drill 0.3)
  Top 0.152: v50.44,31.62 v51.36,30.71 | v35.81,43.2 v40.62,38.41
  Bottom 0.152: 34.78,44.23 33.98,43.43 33.45,43.43 IC103.6 | 34.78,44.23 36.88,46.33 36.88,48.46 R103.1 | v51.36,30.71 51.74,30.33 53.72,30.33 54.33,30.94 56.62,30.94 58.83,33.15 59.51,33.15 60.73,34.37 60.73,34.59 62.26,36.12 62.26,37.26 SV2.10 | v50.44,31.62 47.17,31.62 44.88,33.91 44.88,33.98 44.04,34.82 43.13,34.82 40.62,37.34 v40.62,38.41 | 34.78,44.23 v35.81,43.2
MTX-  (via drill 0.3)
  Top 0.152: v57.91,29.34 57.91,29.64 57.38,30.18 57.38,30.4 56.16,31.62 54.79,31.62 54.18,32.23 v54.18,33.6 | v45.11,42.67 45.11,43.97 44.04,45.03 35.59,45.03 v34.98,45.64
  Bottom 0.152: 34.94,45.68 33.91,44.65 33.45,44.65 IC103.7 | 34.94,45.68 34.98,45.72 34.98,48.46 R103.2 | v57.91,29.34 59.21,30.63 59.51,30.63 60.73,31.85 60.73,32 62.26,33.53 62.26,34.67 SV2.12 | v45.11,42.67 v54.18,33.6 | v34.98,45.64 34.94,45.68
NDX  (via drill 0.3)
  Top 0.152: v34.37,17.6 33.45,18.52 33.45,21.49 40.46,28.5 v40.46,29.72 42.98,32.23 44.04,32.23 44.88,33.07 44.88,37.11 46.33,38.56 v53.49,38.56 | v56.46,41.53 v58.6,41.53
  Bottom 0.152: v40.46,29.72 40.46,30.94 R101.1 | v34.37,17.6 33.68,17.6 32.99,16.92 IC101.14 | v58.6,41.53 58.6,42.6 59.36,43.36 59.59,43.36 61.11,44.88 62.26,44.88 SV2.4 | v53.49,38.56 v56.46,41.53
NMO2RTN  (via drill 0.3)
  Top 0.152: v29.26,17.07 27.89,17.07 25.15,19.81 25.15,19.96 RN2.5 | v30.94,17.07 31.39,17.07 34.59,13.87 35.05,13.87 36.27,15.09 36.27,16.46 39.4,19.58 v42.44,19.58 | v57.53,31.01 57.53,32.77 55.85,34.44 55.85,35.05 IC1.13
  Bottom 0.152: v30.94,17.07 v29.26,17.07 | v42.44,19.58 44.12,19.58 46.02,21.49 49.23,21.49 49.76,22.02 49.76,23.39 48.23,24.92 IC1.6 48.16,24.99 46.41,26.75 46.41,28.73 46.71,29.03 56.77,29.03 57.53,29.79 v57.53,31.01
NMORTN
  Bottom 0.152: RN2.4 22.55,20.04 22.55,20.5 27.13,25.07 27.13,26.36 27.96,27.2 30.1,27.2 32.16,29.26 40.16,29.26 40.23,29.18 42.6,29.18 43.2,29.79 48.01,29.79 48.16,29.95 IC1.4 48.23,30.02 55.78,30.02 IC1.11
NMTRTN  (via drill 0.3)
  Top 0.152: v45.87,37.34 48.16,35.05 IC1.2 | v52.88,31.47 52.88,30.94 54.71,29.11 56.08,29.11 57.38,27.81 57.38,27.05 55.85,25.53 55.85,24.99 IC1.9
  Bottom 0.152: v45.87,37.34 43.2,37.34 41.6,38.94 38.33,38.94 36.96,37.57 35.81,37.57 35.66,37.41 27.89,37.41 27.36,37.95 22.78,37.95 21.64,36.8 21.64,23.16 20.04,21.57 20.04,20.04 RN2.3 | v52.88,31.47 52.27,31.47 48.69,35.05 48.23,35.05 IC1.2
RLY  (via drill 0.3)
  Top 0.152: v32.31,22.63 32.31,21.03 32,20.73 31.39,20.73 29.79,19.13 29.79,10.36 28.88,9.45 27.66,9.45 24.77,6.55 21.03,6.55 R1.2 | v31.93,24.69 31.93,24.99 34.06,27.13 34.06,30.02 v36.04,32
  Bottom 0.152: v32.31,22.63 32.31,23.39 31.93,23.77 v31.93,24.69 | v36.04,32 37.72,32 37.8,32.08 41.38,32.08 42.44,31.01 43.59,31.01 MC1.P$9
RLYDRV
  Top 0.152: T1.B R2.2 24,4.5 25.98,6.48 R1.1
RLYOUT  (via drill 0.3)
  Top 0.152: v24.54,14.55 21.95,17.14 13.11,17.14 11.51,15.54 10.97,15.54 K1.10 | v31.39,14.55 33.45,14.55 v36.04,11.96
  Bottom 0.152: v31.39,14.55 v24.54,14.55 | v36.04,11.96 37.26,11.96 38.1,11.12 41.45,11.12 43.66,8.91 48.84,8.91 50.98,6.78 53.87,6.78 58.06,10.97 63.7,10.97 J4.1
RLYSNK
  Top 0.152: T1.C 17.07,4.57 17.68,4.57 22.25,9.14 23.93,9.14 D2.A
  Bottom 0.152: K1.9 13.49,15.54 15.77,15.54 17.37,17.14 21.41,17.14 22.48,16.08 22.48,10.67 23.93,9.22 D2.A
RST  (via drill 0.3)
  Top 0.152: v57.53,42.75 59.66,44.88 SV2.3 | v46.02,31.09 44.88,29.95 44.88,27.96 44.04,27.13 43.13,27.13 42.37,26.36 42.37,22.1 42.41,22.06 | 42.41,22.06 43.59,20.88 MC1.P$22 | v32,63.09 26.98,58.06 v26.98,56.39 | v29.41,53.11 29.41,52.05 30.18,51.28 v30.18,46.94 | v30.18,40.39 30.18,31.7 32.92,28.96 32.92,26.44 v31.09,24.61 | v34.52,20.65 35.89,22.02 42.37,22.02 42.41,22.06
  Bottom 0.152: v57.53,42.75 57.53,38.86 57.76,38.63 57.76,37.41 58.45,36.73 58.45,33.22 56.46,31.24 54.18,31.24 53.57,30.63 52.2,30.63 51.59,31.24 50.83,31.24 50.67,31.09 v46.02,31.09 | v32,63.09 32,67.59 32.31,67.89 35.81,67.89 36.88,68.96 37.03,68.96 J5.5 | v26.98,56.39 28.42,54.94 28.8,54.94 29.41,54.33 v29.41,53.11 | v30.18,40.39 v30.18,46.94 | v31.09,24.61 31.09,23.55 29.91,22.36 | 29.91,22.36 28.42,20.88 MC1.P$13 | v34.52,20.65 31.62,20.65 29.91,22.36
RX  (via drill 0.3)
  Top 0.152: RX.1 62.94,57.53 60.2,57.53 60.05,57.68 JP3.1 | v46.1,20.8 46.1,22.25 47.17,23.32 48.54,23.32 49.91,24.69 49.91,35.28 48.23,36.96 48.23,37.57 IC1.1 | v64.69,56.62 64.69,45.95 65.68,44.96 65.68,26.9 65,26.21 v65,23.39
  Bottom 0.152: IC101.7 39.09,11.89 39.55,11.89 42.37,14.71 42.37,17.07 43.59,18.29 MC1.P$14 43.66,18.36 v46.1,20.8 46.1,20.73 51.59,20.73 53.57,18.75 60.35,18.75 v65,23.39 | v64.69,56.62 63.63,57.68 60.05,57.68 JP3.1
SCK  (via drill 0.3)
  Top 0.152: v3.73,51.66 3.73,41.07 3.12,40.46 3.12,16.84 v9.75,10.21 | v21.64,7.47 25.15,7.47 28.35,10.67 MC1.P$18
  Bottom 0.152: v3.73,51.66 4.04,51.66 9.45,57.07 9.45,58.83 12.95,62.33 12.95,69.04 13.95,70.03 15.09,70.03 17.75,67.36 18.21,67.36 20.65,69.8 33.53,69.8 34.29,69.04 34.52,69.04 J5.3 | v9.75,10.21 9.75,9.68 11.96,7.47 v21.64,7.47
SCL  (via drill 0.3)
  Top 0.152: v52.43,24 56.84,24 58.37,25.53 59.51,25.53 60.73,26.75 60.73,26.98 61.87,28.12 62.1,28.12 63.93,29.95 63.93,56.62 65.99,58.67 65.99,58.98 J1.3 | v49.38,25.98 47.32,25.98 v46.41,25.07 | v6.33,55.7 v6.33,50.29 6.33,46.94 6.71,46.56 v6.71,31.01 | v33.98,21.26 35.05,22.33 35.81,22.33 41.91,28.42 43.59,28.42 MC1.P$10 | v31.77,21.26 30.56,21.26 28.88,19.58 27.43,19.58 25.45,21.57 17.07,21.57 15.85,20.34 15.85,18.97 15.01,18.14 7.7,18.14 v7.16,18.67
  Bottom 0.152: v52.43,24 51.36,24 v49.38,25.98 | v46.41,25.07 46.41,25.68 43.66,28.42 MC1.P$10 | 8.88,49.42 8.84,49.45 6.33,49.45 | 8.88,49.42 9.37,48.92 9.37,48.46 8.61,47.7 8.61,42.98 6.02,40.39 6.02,39.55 J102.4 | 6.33,49.45 6.02,49.45 J101.4 6.33,49.45 | v6.33,55.7 3.66,58.37 3.05,58.37 RN3.3 | 6.33,49.45 v6.33,50.29 | 8.88,49.42 12.95,53.49 12.95,55.09 14.1,56.24 16.92,56.24 18.06,57.38 18.06,58.6 20.34,60.88 23.77,60.88 JP2.4 | v6.71,31.01 6.71,30.18 6.33,29.79 6.25,29.79 6.02,29.57 J103.4 5.94,29.49 5.64,29.49 4.34,28.19 4.34,24 5.94,22.4 5.94,19.51 J104.4 6.02,19.43 6.4,19.43 v7.16,18.67 | v31.77,21.26 v33.98,21.26
SDA  (via drill 0.3)
  Top 0.152: v51.74,61.04 50.06,61.04 49.3,60.27 34.21,60.27 v33.53,59.59 | v1.45,39.62 1.45,53.72 2.97,55.24 2.97,55.78 RN3.2 | v30.1,5.03 30.1,6.86 31.01,7.77 35.43,7.77 37.34,9.68 37.34,13.72 43.13,19.51 44.04,19.51 44.88,20.34 44.88,23.85 43.66,25.07 43.66,25.91 MC1.P$11 | v8.84,48.69 11.96,48.69 22.4,59.13 22.4,61.27 23.77,62.64 23.77,63.4 JP2.5
  Bottom 0.152: v51.74,61.04 57.61,61.04 57.84,61.27 61.19,61.27 61.42,61.04 65.99,61.04 J1.2 | v33.53,59.59 27.66,59.59 23.85,63.4 JP2.5 | 2.02,39.05 2.06,39.09 5.03,39.09 | 2.02,39.05 1.75,38.79 1.75,38.33 3.58,36.5 3.58,20.57 5.64,18.52 5.94,18.52 J104.3 5.56,18.52 5.03,17.98 5.03,15.93 3.43,14.33 2.59,14.33 1.22,12.95 1.22,12.12 1.83,11.51 3.66,11.51 4.8,10.36 4.8,7.7 5.56,6.93 7.62,6.93 9.68,4.88 9.68,4.8 13.18,1.29 27.13,1.29 30.1,4.27 v30.1,5.03 | 5.03,39.09 5.11,39.09 5.64,38.56 5.94,38.56 J102.3 5.56,38.56 5.03,38.02 5.03,36.12 7.24,33.91 7.24,29.41 6.4,28.57 6.02,28.57 J103.3 | 7.89,47.74 7.92,47.7 7.92,42.75 5.03,39.85 5.03,39.09 | 7.89,47.74 7.16,48.46 6.02,48.46 J101.3 | 2.02,39.05 v1.45,39.62 | 7.89,47.74 v8.84,48.69
THS  (via drill 0.3)
  Top 0.152: v2.29,38.56 2.29,50.98 3.5,52.2 3.89,52.2 4.57,52.88 4.57,58.75 3.05,60.27 3.05,60.88 RN3.4 | v6.1,30.33 6.1,26.44 9.91,22.63 10.13,22.63 11.28,21.49 11.28,21.26 11.89,20.65 13.18,20.65 15.93,23.39 22.86,23.39 24.16,24.69 24.16,26.75 28.35,30.94 MC1.P$26 28.42,30.94 30.02,30.94 32.23,28.73 v32.38,28.73 | v45.8,23.01 45.57,22.78 45.57,13.87 48.77,10.67 48.77,9.45 55.4,2.82 59.44,2.82 61.11,4.5 61.95,4.5 U1.2
  Bottom 0.152: v2.29,38.56 2.29,38.25 6.1,34.44 v6.1,30.33 | v45.8,23.01 44.12,24.69 43.13,24.69 39.93,27.89 39.93,28.35 39.55,28.73 v32.38,28.73
TX
  Top 0.152: IC1.3 48.16,32.54 46.63,31.01 46.63,29.57 48.16,28.04 48.16,27.51 IC1.5 48.08,27.51 45.26,24.69 45.26,18.21 43.66,16.61 43.66,15.77 MC1.P$15
  Bottom 0.152: IC103.4 38.63,42.06 41,42.06 43.2,39.85 44.12,39.85 46.63,37.34 46.63,34.14 48.16,32.61 IC1.3
V+  (via drill 0.3)
  Top 1.016: V+.1 9.53,55.02 11.73,55.02 11.89,55.17 JP1.1 | C2.1 46.48,17.98 47.7,16.76 47.7,13.03 C1.1 48.23,12.88 48.46,12.88 52.05,9.3 52.2,9.3 56.54,4.95 D1.C 56.84,4.57 60.05,7.77 60.05,14.4 64.01,18.36 64.01,26.29 64.92,27.2 v64.92,44.65 | v56.31,57.15 62.26,51.21 62.26,47.47 SV2.2
  Bottom 1.016: 14.48,65.08 14.48,62.33 10.52,58.37 10.52,56.62 11.89,55.24 JP1.1 | 14.48,65.08 14.48,67.89 JP5.3 | V1.IN 53.95,15.47 50.22,15.47 47.78,13.03 C1.1 | v64.92,44.65 62.33,47.24 62.33,47.4 SV2.2 | 14.48,65.08 25.3,65.08 29.49,60.88 46.71,60.88 48.46,62.64 49.53,62.64 50.75,61.42 50.75,60.66 54.25,57.15 v56.31,57.15
VCC  (via drill 0.3)
  Top 0.508: v7.39,47.47 12.34,47.47 14.4,45.41 | 14.4,45.41 14.4,44.58 13.72,43.89 11.81,43.89 | 11.81,43.89 10.74,44.96 C8.1 | 14.4,45.41 14.63,45.49 14.86,45.72 17.3,45.72 18.36,44.65 23.77,44.65 IC2.14 23.85,44.88 25.45,46.48 25.45,50.75 23.85,52.35 23.85,53.26 JP2.1 23.93,53.49 v25.38,54.94 | 11.81,43.89 11.73,43.66 10.74,42.67 10.74,41.07 C9.1 10.52,41.38 8.99,41.38 8.46,40.84 8.46,31.7 7.32,30.56 v7.32,28.19 | JP5.2 11.96,67.89 11.96,62.03 15.7,58.29 15.7,56.39 14.55,55.24 JP1.3 | v36.8,16.23 v36.8,9.91 | 36.27,26.29 33.83,23.85 28.88,23.85 28.42,23.39 MC1.P$23 | 36.27,26.29 37.34,27.36 v37.34,29.79 37.26,30.02 37.26,31.85 33.98,35.13 33.98,36.96 v35.43,38.41 | C5.1 8.76,4.57 8.76,5.79 13.41,10.44 K1.2 13.34,10.67 v11.51,12.5 | v17.22,17.68 23.09,17.68 23.93,16.84 D2.C | v36.12,26.44 36.27,26.29 | v34.29,66.45 33.3,67.44 33.3,68.96 J5.2 | v34.29,63.09 34.29,61.42 32.77,59.89 32.77,58.83 | 32.77,58.83 32.77,57.61 33.15,57.23 RN4.3 | 32.77,58.83 33.83,58.83 33.98,58.98 36.12,58.98 37.87,57.23 38.25,57.23 RN4.5 38.48,57.3 40.16,58.98 41.22,58.98 42.98,57.23 43.28,57.23 RN4.7 43.59,57.15 45.34,55.4 v45.95,55.4 | v57.38,61.57 57.38,61.19 55.55,59.36 | 55.55,59.36 50.75,54.56 C6.1 | v63.02,18.82 59.74,22.1 59.74,24.54 SV2.19 | v64.47,17.37 64.47,4.57 U1.3 | C7.1 53.34,41 53.34,40.08 55.78,37.64 IC1.14 | v53.34,46.48 53.34,49.3 55.78,51.74 OK1.8 | v57.38,57.53 55.55,59.36
  Bottom 0.508: RN3.1 3.05,53.34 5.03,53.34 8.91,57.23 8.91,59.59 11.89,62.56 11.89,67.89 JP5.2 | JP1.3 14.55,55.17 15.39,55.17 17.22,53.34 23.77,53.34 JP2.1 | J104.2 6.02,17.53 7.09,17.53 7.92,18.36 7.92,21.11 4.88,24.16 4.88,26.98 5.33,27.43 5.94,27.43 J103.2 6.25,27.51 6.63,27.51 v7.32,28.19 | J102.2 6.02,37.57 7.77,37.57 10.67,40.46 10.67,41 C9.1 | v7.39,47.47 6.02,47.47 J101.2 | v36.8,9.91 36.8,8.53 C101.1 | 34.37,18.67 33.6,19.43 32.99,19.43 IC101.16 | 34.37,18.67 v36.8,16.23 | 34.37,18.67 36.8,21.11 36.8,21.95 C102.1 36.88,22.25 36.88,25.45 36.01,26.33 | 36.01,26.33 34.44,27.89 33.45,27.89 IC102.8 | v37.34,29.79 38.48,30.94 R101.2 | v17.22,17.68 14.94,19.96 RN2.1 15.16,19.43 12.34,16.61 12.34,14.78 11.51,13.95 v11.51,12.5 | MC1.P$23 28.35,23.32 28.35,22.78 26.21,20.65 26.21,18.9 24.16,16.84 24,16.84 D2.C | v36.12,26.44 36.01,26.33 | 37.72,49.76 34.21,49.76 33.45,49 33.45,45.95 IC103.8 | 37.72,49.76 40.16,47.32 40.16,45.41 39.4,44.65 38.86,44.65 IC103.2 38.63,44.58 38.63,43.59 IC103.3 38.56,43.36 37.87,43.36 36.88,42.37 36.88,40.01 C103.1 36.73,39.78 36.73,39.55 35.59,38.41 v35.43,38.41 | v34.29,63.09 v34.29,66.45 | v45.95,55.4 46.79,54.56 50.67,54.56 C6.1 | v57.38,61.57 57.38,63.4 55.55,65.23 55.55,65.99 J2.2 | 37.72,49.76 43.05,55.09 43.05,56.92 43.28,57.15 RN4.7 | v64.47,17.37 v63.02,18.82 63.09,19.05 63.09,19.36 68.12,24.38 68.12,44.04 65.76,46.41 65.76,54.79 J1.5 65.99,55.02 65.23,55.02 64.08,56.16 59.66,56.16 59.21,55.7 | 59.21,55.7 55.85,52.35 55.85,51.82 OK1.8 | v53.34,46.48 53.34,41.07 C7.1 | 59.21,55.7 v57.38,57.53 | v25.38,54.94 25.38,56.69 27.66,58.98 31.39,58.98 33.15,57.23 RN4.3
VCC/2  (via drill 0.3)
  Top 1.016: RN4.16 28.04,64.85 27.81,65.08 23.09,65.08 21.64,63.63 21.64,60.05 17.07,55.47 17.07,55.24 JP1.5 16.76,54.79 v15.62,53.65 | v9.37,40.46 9.68,40.16 9.68,36.96 SV1.16
  Bottom 1.016: SV1.4 9.68,21.72 9.68,22.25 8.31,23.62 8.31,25.3 9.68,26.67 SV1.8 9.53,27.2 8.31,28.42 8.31,29.79 9.68,31.17 9.68,31.77 SV1.12 9.45,32.23 8.31,33.38 8.31,35.13 9.68,36.5 9.68,36.88 SV1.16 | R3.2 51.97,62.56 51.28,62.56 49.99,63.86 47.47,63.86 45.72,62.1 30.79,62.1 28.12,64.77 RN4.16 | v9.37,40.46 9.37,47.4 v15.62,53.65
VIN  (via drill 0.3)
  Top 1.016: JP1.2 11.89,57.84 11.73,57.99 9.53,57.99 VIN.1 9.14,57.61 7.32,55.78 v7.32,52.73 | v5.79,41.68 5.79,31.39 5.11,30.71 5.11,18.82 10.44,13.49 26.14,13.49 28.35,15.7 MC1.P$20
  Bottom 1.016: v7.32,52.73 4.65,50.06 4.65,42.82 v5.79,41.68
VOUT  (via drill 0.3)
  Top 1.016: v30.86,6.55 31.32,7.01 33.98,7.01 36.2,4.8 38.48,4.8 F1.2 | v8.38,13.87 3.89,18.36 3.89,40.16 4.57,40.84 4.57,51.13 5.33,51.89 5.33,56.69 8.61,59.97 12.34,59.97 14.48,57.84 JP1.4
  Bottom 1.016: JP1.4 14.55,57.76 16.99,57.76 JP1.6 | v30.86,6.55 27.96,6.55 23.93,2.52 13.87,2.52 12.65,3.73 12.65,5.71 8.38,9.98 v8.38,13.87
VOUTRAW  (via drill 0.3)
  Top 1.016: C3.1 46.48,7.92 46.48,7.24 49.15,4.57 D1.A | 58.48,14.67 54.33,10.52 54.03,10.52 V1.OUT 54.56,10.06 55.7,8.91 v55.7,7.54 | 58.48,14.67 60.2,16.38 60.2,19.96 C4.1 | v58.83,14.33 58.48,14.67 | v25.91,10.82 23.32,10.82 23.01,10.52 21.11,10.52 K1.5
  Bottom 1.016: 20.12,11.43 17.07,11.43 VOR.1 | 20.12,11.43 21.03,10.52 K1.5 | K1.6 21.03,15.47 21.03,12.57 20.34,11.89 20.12,11.43 | v58.83,14.33 60.12,13.03 63.7,13.03 J4.2 | v55.7,7.54 52.73,4.57 49.23,4.57 D1.A | v25.91,10.82 28.65,8.08 32.77,8.08 33.76,7.09 45.57,7.09 46.41,7.92 C3.1
VOUTRAW2  (via drill 0.3)
  Top 1.016: v22.78,3.73 23.39,3.12 29.57,3.12 31.17,4.72 33.45,4.72 F1.1 | v63.55,16.23 63.55,12.12 v61.27,9.83
  Bottom 1.016: 13.53,13.07 10.97,10.52 K1.1 | 13.53,13.07 14.94,14.48 16.99,14.48 VO.1 | v22.78,3.73 22.63,3.89 22.63,7.85 22.02,8.46 17.14,8.46 14.78,10.82 14.78,11.81 13.53,13.07 | v63.55,16.23 63.7,16.08 63.7,15.01 J4.3 | v61.27,9.83 59.66,9.83 52.73,2.9 48.23,2.9 45.26,5.87 42.44,5.87 39.09,2.52 35.74,2.52 33.53,4.72 F1.1

### Text on the board
tNames: GPIO | SPI | GPIO (5V) | PWR | Pineapple II | 2.7.1-GM | GPIO | N | N | 0 | 1 | I | V | C | O | R | G | GND | RTC1 | MNTR | SD | SC | 221 | (OUT2) | (OUT2) | 102 | MKR | NC | 100n | G | 102 | USB | 102 | Close / Here | 4.7k | 5V | This pin / pulls up / U1 | SparkFun / Real Time Clock / Module (12708) | (3V3) | Min. requirement / for MIDI IN | TLP2630 | MNTR | L00 | GeekPort II | 100n | 4066B | MNTR | 74LS06 | BackPort II | 10k | Vcc | 100n | 4.7k | 470n | Vin | Min. requirement / for MIDI OUT | (JP4) | + | + | 5V1.5A | Arduino Micro | MC1 | 1u | C1815 | 102 | 1A | LED | 473 | DS18B20+ | Pineapple Computer (2022)
bNames: G | Vcc | V+ | N | N | 0 | 1 | I | V | C | O | R | G | G | V | G0 | G1 | To ICB-288> | OUT2 | V+ | GND | MN | GND | JP3 | U1 | *Cut this pin to use LM35 | L00 | SND | RTN | SDA | Vin (MC) | Vout (Reg) | Vout (Reg) | SCL | SC | D7 | SD | PWRSEL | Close | Vcc | Qwiic/5V | Ext. V+ | Vcc | Vcc/2 | Vcc | SND | 3V3 | RTN | PWRSEL | MIDI / IN | A0 | Dual | A0 | LTC485 | L00 / Vcc/2 / Monitor | A1 | Single | A2 | TX | A3 | A1 | A3 | Arduino | Direct 5V | A2 | MIDI / OUT | A0 | A1 | A2 | A3 | LTC485 | Vcc | Bottom / View | Vcc | Relay | Vin | V+ | 74153 | Open JP3 | NC | LED1 | Don't Close | C | NO | Voutraw | RX | LED0 | You can istall LM35* instead of DS18B20+ | Vout | *Cut pull-up R to install LM35